# Altium project ip_phone.PrjPcb (part 1 of 2)
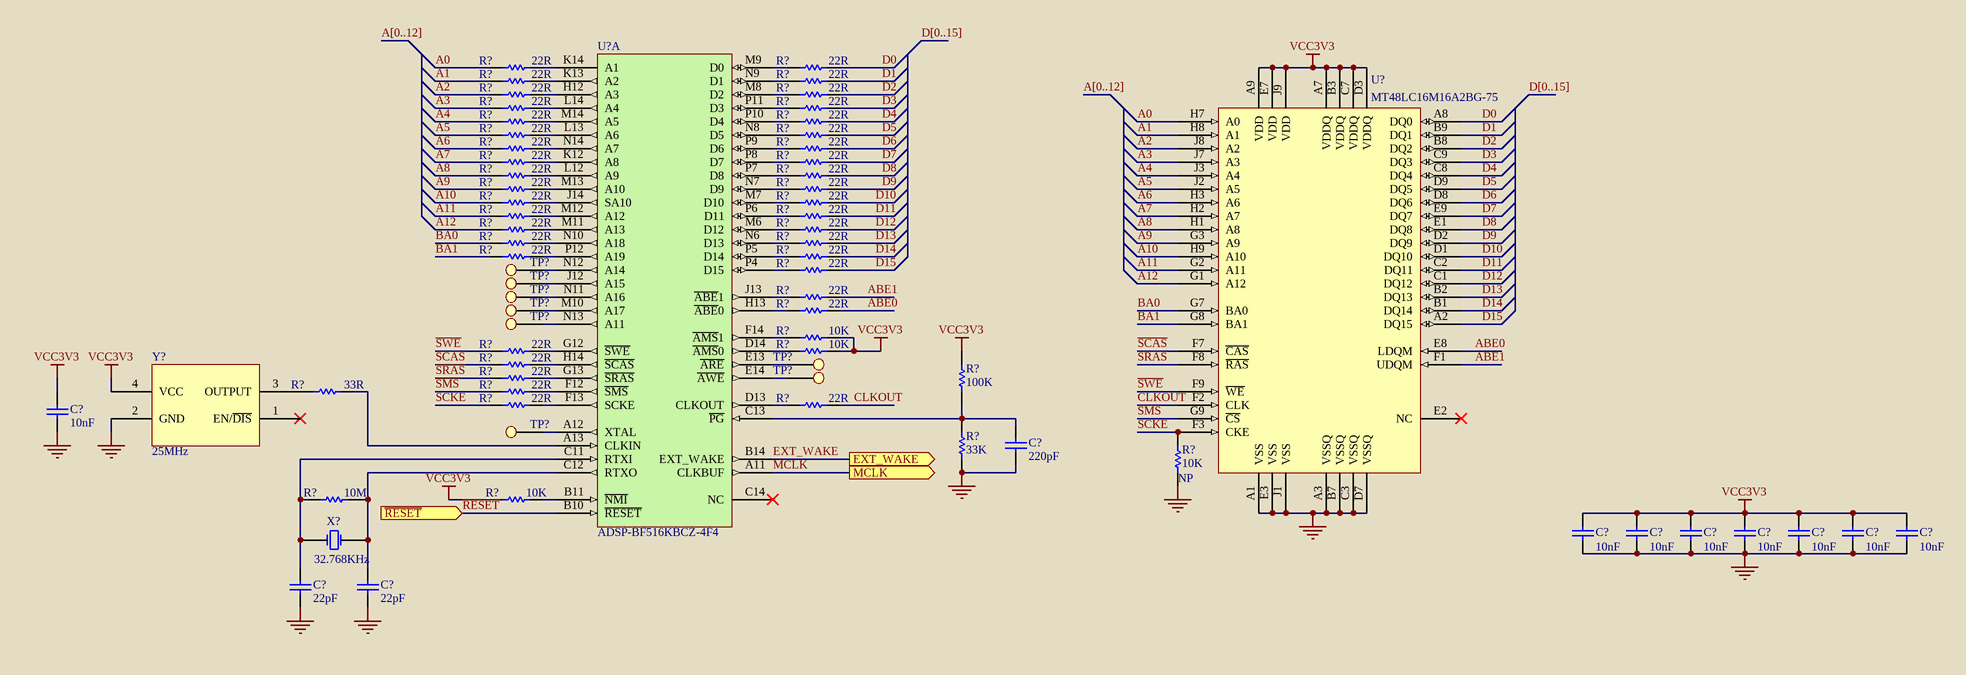
[diagram p0: ip_phone_a_sdram.SchDoc]
6 sheets, 384 parts. Net scope: flat (ports and power ports of the same name join across sheets).
Board file: ip_phone_pcb.PcbDoc
Sheets:
  ip_phone_a_sdram.SchDoc
  ip_phone_b_miscellaneous.SchDoc
  ip_phone_c_codec.SchDoc
  ip_phone_d_lcd_keyboard.SchDoc
  ip_phone_e_wifi.SchDoc
  ip_phone_f_power.SchDoc

## Sheet ip_phone_a_sdram.SchDoc: SDRAM
size A3; SheetNumber: 1; SheetTotal: 6

### Parts
C100  10nF  [CC1005-0402]
C101  220pF  [CC1005-0402]
C102  10nF  [CC1005-0402]
C103  10nF  [CC1005-0402]
C104  10nF  [CC1005-0402]
C105  10nF  [CC1005-0402]
C106  10nF  [CC1005-0402]
C107  10nF  [CC1005-0402]
C108  10nF  [CC1005-0402]
C109  22pF  [CC1005-0402]
C110  22pF  [CC1005-0402]
R100  22R  [CR1005-0402]
R101  22R  [CR1005-0402]
R102  22R  [CR1005-0402]
R103  22R  [CR1005-0402]
R104  22R  [CR1005-0402]
R105  22R  [CR1005-0402]
R106  22R  [CR1005-0402]
R107  22R  [CR1005-0402]
R108  22R  [CR1005-0402]
R109  22R  [CR1005-0402]
R110  22R  [CR1005-0402]
R111  22R  [CR1005-0402]
R112  22R  [CR1005-0402]
R113  22R  [CR1005-0402]
R114  22R  [CR1005-0402]
R115  22R  [CR1005-0402]
R116  22R  [CR1005-0402]
R117  22R  [CR1005-0402]
R118  22R  [CR1005-0402]
R119  22R  [CR1005-0402]
R120  22R  [CR1005-0402]
R121  22R  [CR1005-0402]
R122  22R  [CR1005-0402]
R123  22R  [CR1005-0402]
R124  22R  [CR1005-0402]
R125  22R  [CR1005-0402]
R126  22R  [CR1005-0402]
R127  22R  [CR1005-0402]
R128  22R  [CR1005-0402]
R129  22R  [CR1005-0402]
R130  22R  [CR1005-0402]
R131  22R  [CR1005-0402]
R132  22R  [CR1005-0402]
R133  10K  [CR1005-0402]
R134  22R  [CR1005-0402]
R135  10K  [CR1005-0402]
R136  22R  [CR1005-0402]
R137  100K  [CR1005-0402]
R138  22R  [CR1005-0402]
R139  33R  [CR1005-0402]
R140  22R  [CR1005-0402]
R141  22R  [CR1005-0402]
R142  22R  [CR1005-0402]
R143  33K  [CR1005-0402]
R144  10K  [CR1005-0402_NP]
R145  10M  [CR1005-0402]
R146  10K  [CR1005-0402]
TP100  Test Point  [Test Point]  (value not drawn)
TP101  Test Point  [Test Point]  (value not drawn)
TP102  Test Point  [Test Point]  (value not drawn)
TP103  Test Point  [Test Point]  (value not drawn)
TP104  Test Point  [Test Point]  (value not drawn)
TP105  Test Point  [Test Point]  (value not drawn)
TP106  Test Point  [Test Point]  (value not drawn)
TP107  Test Point  [Test Point]  (value not drawn)
U101  MT48LC16M16A2BG-75  [VFBGA54]
U?  ADSP-BF516KBCZ-4F4  [BGA168]  (part A of 3)
X100  32.768KHz  [XTAL_32.768kHz]
Y100  25MHz  [OSC_25MHz]

### Ports
EXT_WAKE (out), MCLK (out), ~{RESET} (in)

### Nets
GND: C100.1 C101.1 C102.1 C103.1 C104.1 C105.1 C106.1 C107.1 C108.1 C109.1 C110.1 R143.1 R144.1 U101.A1(VSS) U101.A3(VSSQ) U101.B7(VSSQ) U101.C3(VSSQ) U101.D7(VSSQ) U101.E3(VSS) U101.J1(VSS) Y100.2(GND)  [project net AGND]
VCC3V3: C100.2 C102.2 C103.2 C104.2 C105.2 C106.2 C107.2 C108.2 R133.2 R135.2 R137.2 R146.1 U101.A7(VDDQ) U101.A9(VDD) U101.B3(VDDQ) U101.C7(VDDQ) U101.D3(VDDQ) U101.E7(VDD) U101.J9(VDD) Y100.4(VCC)
~{RESET}: U?.B10(~{RESET}) ; port ~{RESET}
A0: R100.1 U101.H7(A0)
A1: R102.1 U101.H8(A1)
A2: R104.1 U101.J8(A2)
A3: R106.1 U101.J7(A3)
A4: R108.1 U101.J3(A4)
A5: R110.1 U101.J2(A5)
A6: R112.1 U101.H3(A6)
A7: R114.1 U101.H2(A7)
A8: R116.1 U101.H1(A8)
A9: R118.1 U101.G3(A9)
A10: R120.1 U101.H9(A10)
A11: R122.1 U101.G2(A11)
A12: R124.1 U101.G1(A12)
ABE0: R132.2 U101.E8(LDQM)
ABE1: R131.2 U101.F1(UDQM)
BA0: R126.1 U101.G7(BA0)
BA1: R128.1 U101.G8(BA1)
CLKOUT: R142.2 U101.F2(CLK)
D0: R101.2 U101.A8(DQ0)
D1: R103.2 U101.B9(DQ1)
D2: R105.2 U101.B8(DQ2)
D3: R107.2 U101.C9(DQ3)
D4: R109.2 U101.C8(DQ4)
D5: R111.2 U101.D9(DQ5)
D6: R113.2 U101.D8(DQ6)
D7: R115.2 U101.E9(DQ7)
D8: R117.2 U101.E1(DQ8)
D9: R119.2 U101.D2(DQ9)
D10: R121.2 U101.D1(DQ10)
D11: R123.2 U101.C2(DQ11)
D12: R125.2 U101.C1(DQ12)
D13: R127.2 U101.B2(DQ13)
D14: R129.2 U101.B1(DQ14)
D15: R130.2 U101.A2(DQ15)
EXT_WAKE: U?.B14(EXT_WAKE) ; port EXT_WAKE
MCLK: U?.A11(CLKBUF) ; port MCLK
~{SCAS}: R136.1 U101.F7(~{CAS})
~{SMS}: R140.1 U101.G9(~{CS})
~{SRAS}: R138.1 U101.F8(~{RAS})
~{SWE}: R134.1 U101.F9(~{WE})
SCKE: R141.1 R144.2 U101.F3(CKE)
NetC101_2: C101.2 R137.1 R143.2 U?.C13(~{PG})
NetC109_2: C109.2 R145.1 U?.C11(RTXI) X100.1(OSC1)
NetC110_2: C110.2 R145.2 U?.C12(RTXO) X100.4(OSC2)
NetR100_2: R100.2 U?.K14(A1)
NetR101_1: R101.1 U?.M9(D0)
NetR102_2: R102.2 U?.K13(A2)
NetR103_1: R103.1 U?.N9(D1)
NetR104_2: R104.2 U?.H12(A3)
NetR105_1: R105.1 U?.M8(D2)
NetR106_2: R106.2 U?.L14(A4)
NetR107_1: R107.1 U?.P11(D3)
NetR108_2: R108.2 U?.M14(A5)
NetR109_1: R109.1 U?.P10(D4)
NetR110_2: R110.2 U?.L13(A6)
NetR111_1: R111.1 U?.N8(D5)
NetR112_2: R112.2 U?.N14(A7)
NetR113_1: R113.1 U?.P9(D6)
NetR114_2: R114.2 U?.K12(A8)
NetR115_1: R115.1 U?.P8(D7)
NetR116_2: R116.2 U?.L12(A9)
NetR117_1: R117.1 U?.P7(D8)
NetR118_2: R118.2 U?.M13(A10)
NetR119_1: R119.1 U?.N7(D9)
NetR120_2: R120.2 U?.J14(SA10)
NetR121_1: R121.1 U?.M7(D10)
NetR122_2: R122.2 U?.M12(A12)
NetR123_1: R123.1 U?.P6(D11)
NetR124_2: R124.2 U?.M11(A13)
NetR125_1: R125.1 U?.M6(D12)
NetR126_2: R126.2 U?.N10(A18)
NetR127_1: R127.1 U?.N6(D13)
NetR128_2: R128.2 U?.P12(A19)
NetR129_1: R129.1 U?.P5(D14)
NetR130_1: R130.1 U?.P4(D15)
NetR131_1: R131.1 U?.J13(~{ABE}1)
NetR132_1: R132.1 U?.H13(~{ABE}0)
NetR133_1: R133.1 U?.F14(~{AMS}1)
NetR134_2: R134.2 U?.G12(~{SWE})
NetR135_1: R135.1 U?.D14(~{AMS}0)
NetR136_2: R136.2 U?.H14(~{SCAS})
NetR138_2: R138.2 U?.G13(~{SRAS})
NetR139_1: R139.1 Y100.3(OUTPUT)
NetR139_2: R139.2 U?.A13(CLKIN)
NetR140_2: R140.2 U?.F12(~{SMS})
NetR141_2: R141.2 U?.F13(SCKE)
NetR142_1: R142.1 U?.D13(CLKOUT)
NetR146_2: R146.2 U?.B11(~{NMI})
NetTP100_1: TP100.1 U?.J12(A15)
NetTP101_1: TP101.1 U?.N11(A16)
NetTP102_1: TP102.1 U?.M10(A17)
NetTP103_1: TP103.1 U?.N13(A11)
NetTP104_1: TP104.1 U?.E13(~{ARE})
NetTP105_1: TP105.1 U?.E14(~{AWE})
NetTP106_1: TP106.1 U?.A12(XTAL)
NetTP107_1: TP107.1 U?.N12(A14)

Not connected (* = marked no-connect by the designer): U101 E2(NC)*; U? C14(NC)*; Y100 1(EN/~{DIS})*

### Buses and harness runs
bus A[0..12]
bus D[0..15]

### Notes on the sheet
- Título:
- Universidade Federal do Ceará
- Padrão:
- Projeto:
- A3
- Blackfin IP Phone
- Data:
- Versão:
- Folha:
- V1
- de
- Centro de Tecnologia
- Dep. de Eng. de Teleinformática
- Fortaleza - Ceará - Brasil
- Arquivo:

### Library data of the parts
C100 = Capacitor: Ceramic Capacitor 10nF 50V X7R 0402; eVendorPart#: 311-1349-1-ND; Manufacturer: Yageo; Part#: CC0402KRX7R9BB103; eVendor: Digikey; eVendorPrice: 0,015; MSRP: 0,00335; MOQ: 1000
C101 = Capacitor: eVendorPart#: 311-1035-1-ND; Manufacturer: Yageo; Part#: CC0402KRX7R9BB221; eVendor: Digikey; eVendorPrice: 0,015; MSRP: 0,00335; MOQ: 1000
C102-C108 = Capacitor: Ceramic Capacitor 0.01uF 50V X7R 0402; eVendorPart#: 311-1349-1-ND; Manufacturer: Yageo; Part#: CC0402KRX7R9BB103; eVendor: Digikey; eVendorPrice: 0,015; MSRP: 0,00335; MOQ: 1000
C109 C110 = Capacitor: Ceramic Capacitor 22pF 50V 5% C0G 0402; eVendorPart#: 490-1283-1-ND; Manufacturer: Murata Electronics North America; Part#: GRM1555C1H220JZ01D; eVendor: Digikey; eVendorPrice: 0,028; MSRP: 0,00614; MOQ: 1000
R100-R132 R134 R136 R138 R140-R142 = Resistor: Thick Film Resistors SMD 0402 22R 5%  1/16 W; eVendorPart#: 71-CRCW0402J-22-E3; Manufacturer: Vishay/Dale; Part#: CRCW040222R0JNED; eVendor: Mouser; eVendorPrice: 0,08; MSRP: 0,015; MOQ: 1000
R133 = Resistor: Thick Film Resistors SMD 0402 10k 5%  1/16 W; eVendorPart#: 311-10KJRCT-ND; Manufacturer: Yageo; Part#: RC0402JR-0710KL; eVendor: Digikey; eVendorPrice: 0,012; MSRP: 0,00253; MOQ: 1000
R135 = Resistor: Thick Film Resistors SMD 0402 10k 5%  1/16 W; eVendorPart#: 311-10KJRCT-ND; Manufacturer: Yageo; Part#: RC0402JR-0710KL; eVendor: Digikey; eVendorPrice: 0,0012; MSRP: 0,00253; MOQ: 1000
R137 = Resistor: Thick Film Resistors SMD 0402 100K 5%  1/16 W; eVendorPart#: 311-100KJRCT-ND; Manufacturer: Yageo; Part#: RC0402JR-07100KL; eVendor: Digikey; eVendorPrice: 0,012; MSRP: 0,00253; MOQ: 1000
R139 = Resistor: Thick Film Resistors SMD 0402 33R 5%  1/16 W; eVendorPart#: 311-33JRCT-ND; Manufacturer: Yageo; Part#: RC0402JR-0733RL; eVendor: Digikey; eVendorPrice: 0,012; MSRP: 0,00253; MOQ: 1000
R143 = Resistor: Thick Film Resistors SMD 0402 33K 5%  1/16 W; eVendorPart#: 311-33KJRCT-ND; Manufacturer: Yageo; Part#: RC0402JR-0733KL; eVendor: Digikey; eVendorPrice: 0,012; MSRP: 0,00253; MOQ: 1000
R144 R146 = Resistor: Thick Film Resistors SMD 0402 10K 5%  1/16 W; eVendorPart#: 311-10KJRCT-ND; Manufacturer: Yageo; Part#: RC0402JR-0710KL; eVendor: Digikey; eVendorPrice: 0,012; MSRP: 0,00253; MOQ: 1000
  R?#45: NP: NP
R145 = Resistor: Thick Film Resistors SMD 0402 10M 5%  1/16 W; eVendorPart#: RMCF0402JT10M0CT-ND; Manufacturer: Stackpole Electronics Inc; Part#: RMCF0402JT10M0; eVendor: Digikey; eVendorPrice: 0,02; MSRP: 0,00256; MOQ: 1000
TP100-TP107 = Test Point: eVendor: NÃO SE APLICA; eVendorPrice: 0,00; eVendorPart#: NÃO SE APLICA; Part#: NÃO SE APLICA; Manufacturer: NÃO SE APLICA; MOQ: 1000; MSRP: 0,00
U101 = MT48LC16M16A2BG-75: SDRAM 256M-Bit 16Mx16 3.3V 54-Pin VFBGA Tray; eVendorPart#: MT48LC16M16A2BG-75 IT:D; Manufacturer: Micron; eVendor: Avnet; eVendorPrice: 9,23; MSRP: 8,33; eVendorPart#: ADSP-BF516KBCZ-4F4; MOQ: 500; Part#: ADSP-BF516KBCZ-4F4
U? = ADSP-BF516KBCZ-4F4: Low Power Blackfin with Advanced Embedded Connectivity; Manufacturer: Analog Device; eVendor: Avnet; eVendorPrice: 19,42; MSRP: 14,15; MOQ: 100; Part#: MT48LC16M16A2BG-75 IT:D
X100 = XTAL_32.768KHz: Crystal 32.768KHz; eVendorPart#: 732-MC30632.7680KA0R; Part#: MC-306 32.7680K-A0:ROHS; Manufacturer: Epson; eVendor: Mouser; eVendorPrice: 0,95; MSRP: 0,378; MOQ: 1000
Y100 = Oscillator_25MHz: Crystal Clock Oscillator 25MHz  50ppm 3.3V; eVendorPart#: 300-8254-1-ND; Part#: ASFL1-25.000MHZ-EC-T; Manufacturer: ABRACON; eVendor: Digikey; eVendorPrice: 2,55; MSRP: 1,292; MOQ: 1000

## Sheet ip_phone_b_miscellaneous.SchDoc: MISCELLANEOUS
size A3; SheetNumber: 2; SheetTotal: 6
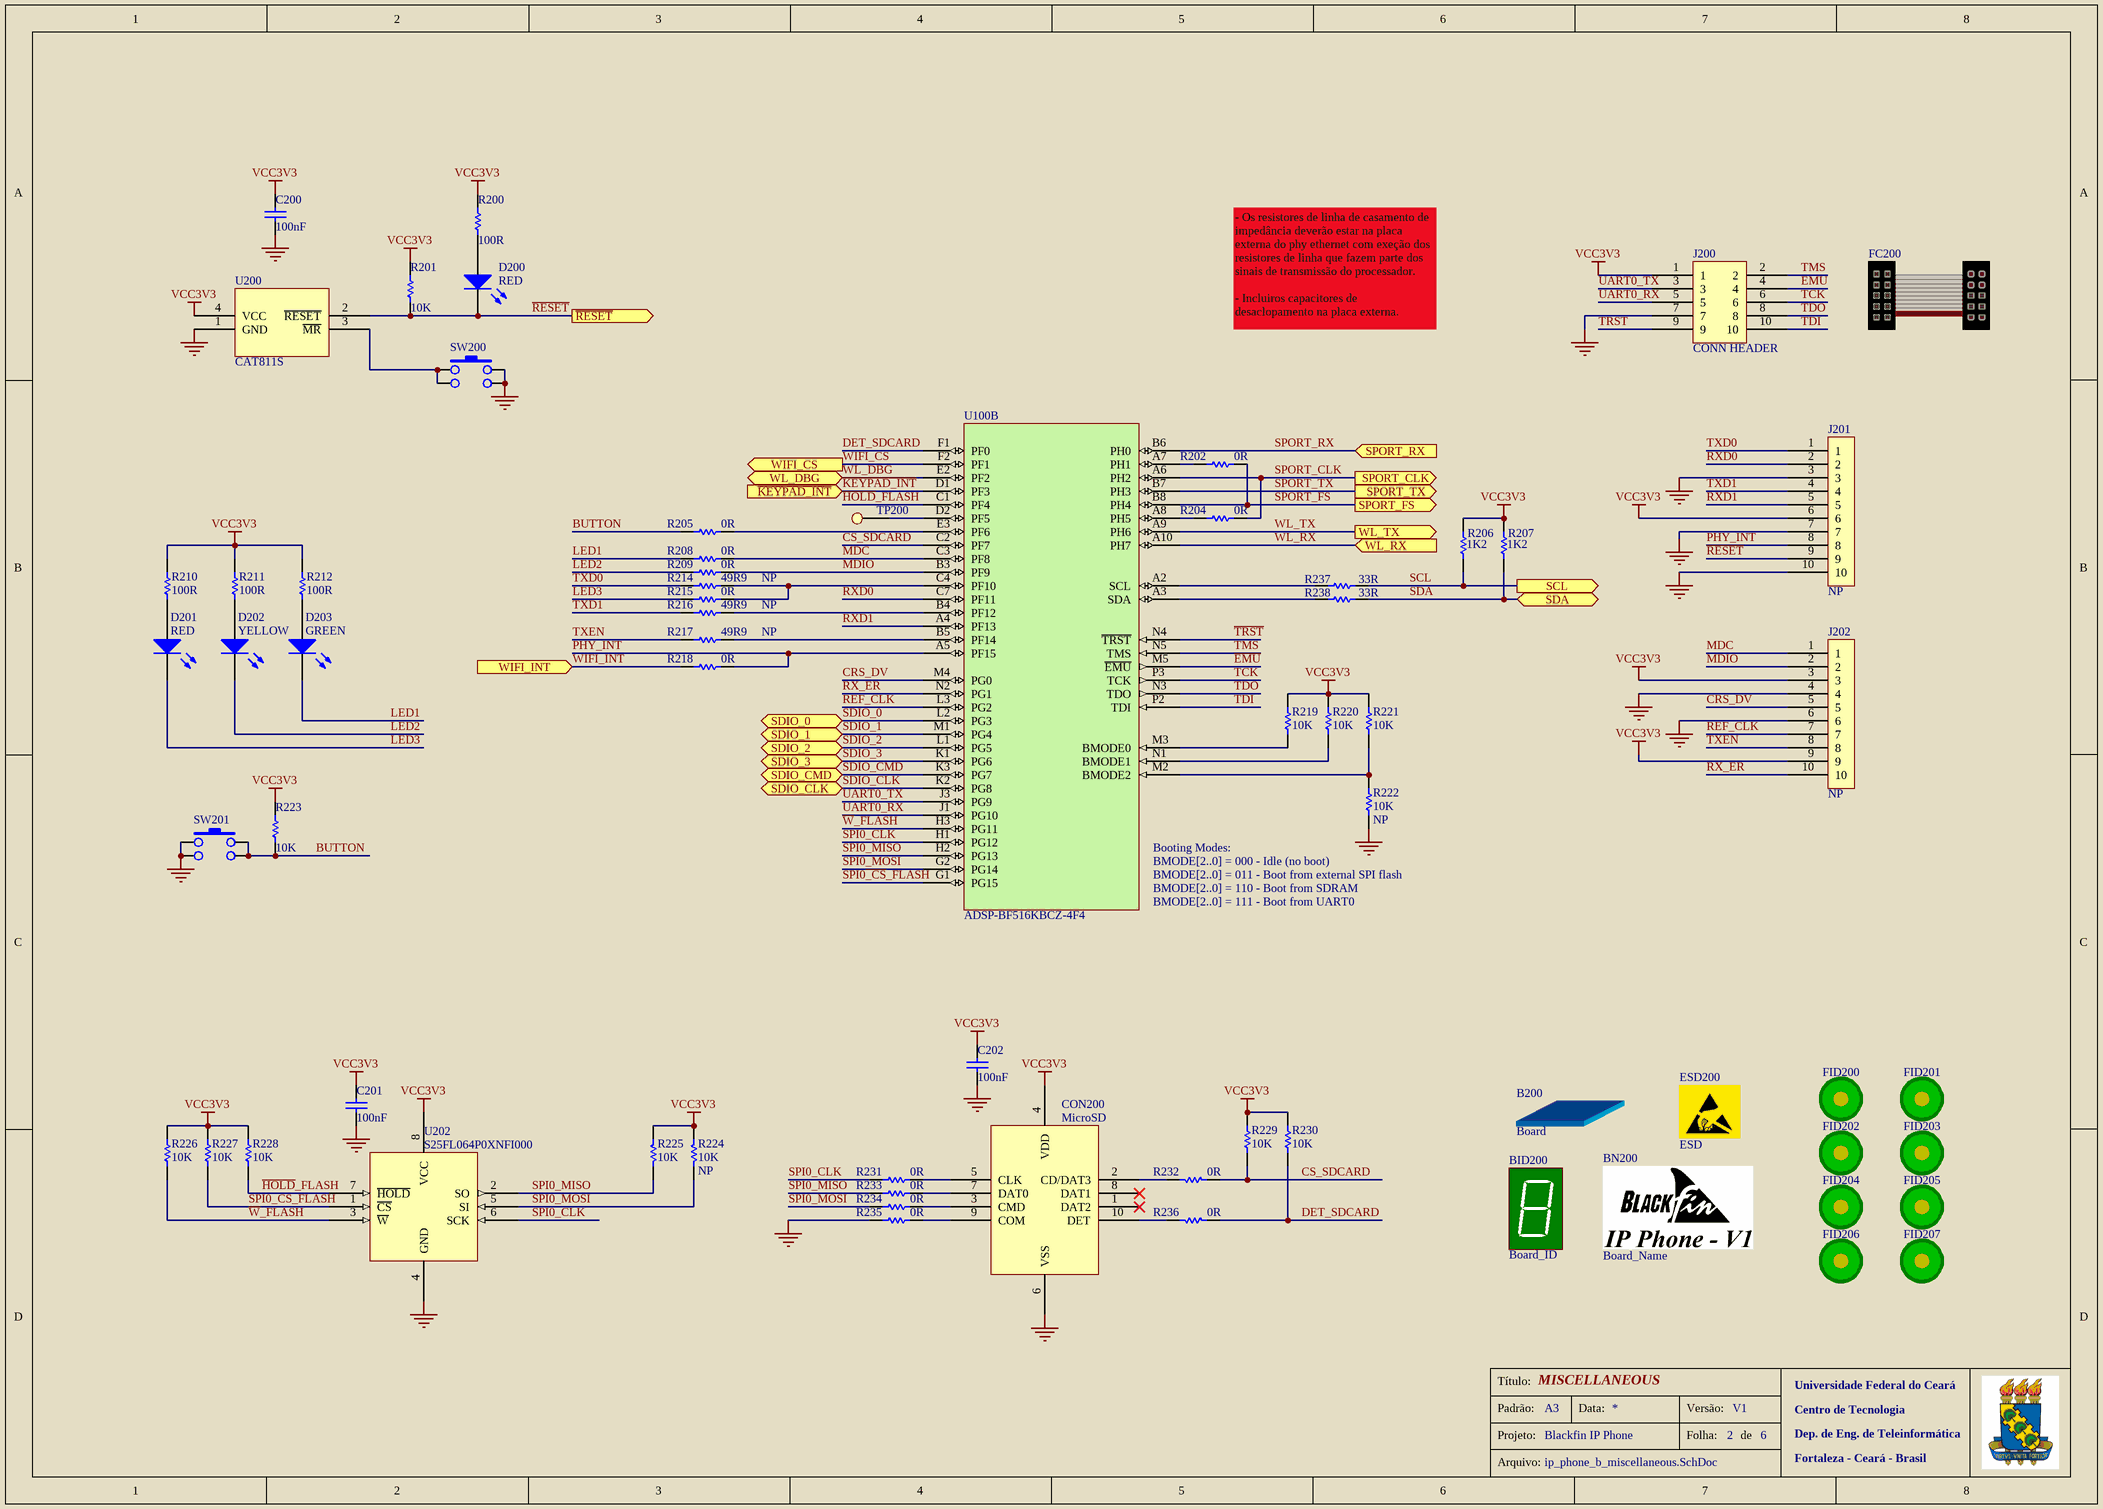
[diagram p1: ip_phone_b_miscellaneous.SchDoc]

### Parts
B200  Board  (no BOM)
BID200  Board_ID  [BOARD_ID]  (no BOM)
BN200  Board_Name  [LOGO]  (no BOM)
C200  100nF  [CC1005-0402]
C201  100nF  [CC1005-0402]
C202  100nF  [CC1005-0402]
CON200  MicroSD  [MICRO_SD]
D200  RED  [LED_0603]
D201  RED  [LED 3MM VERMELHO PF-D3]
D202  YELLOW  [LED 3MM AMARELO PF-D3]
D203  GREEN  [LED 3MM VERDE PF-D3]
ESD200  ESD  [ESD]  (no BOM)
FC200  Flat Cable  (value not drawn)  (mechanical)
FID200  Fiducial  [Fiducial]  (value not drawn)  (no BOM)
FID201  Fiducial  [Fiducial]  (value not drawn)  (no BOM)
FID202  Fiducial  [Fiducial]  (value not drawn)  (no BOM)
FID203  Fiducial  [Fiducial]  (value not drawn)  (no BOM)
FID204  Fiducial  [Fiducial]  (value not drawn)  (no BOM)
FID205  Fiducial  [Fiducial]  (value not drawn)  (no BOM)
FID206  Fiducial  [Fiducial]  (value not drawn)  (no BOM)
FID207  Fiducial  [Fiducial]  (value not drawn)  (no BOM)
J200  CONN HEADER  [CON_JTAG]
J201  CONN HEADER  [CONECTOR_10_PIN]  (value not drawn)
J202  CONN HEADER  [CONECTOR_10_PIN]  (value not drawn)
R200  100R  [CR1608-0603]
R201  10K  [CR1005-0402]
R202  0R  [CR1005-0402]
R204  0R  [CR1005-0402]
R205  0R  [CR1005-0402]
R206  1K2  [CR1005-0402]
R207  1K2  [CR1005-0402]
R208  0R  [CR1005-0402]
R209  0R  [CR1005-0402]
R210  100R  [CR1608-0603]
R211  100R  [CR1608-0603]
R212  100R  [CR1608-0603]
R214  49R9  [CR1005-0402_NP]
R215  0R  [CR1005-0402]
R216  49R9  [CR1005-0402_NP]
R217  49R9  [CR1005-0402_NP]
R218  0R  [CR1005-0402]
R219  10K  [CR1005-0402]
R220  10K  [CR1005-0402]
R221  10K  [CR1005-0402]
R222  10K  [CR1005-0402_NP]
R223  10K  [CR1005-0402]
R224  10K  [CR1005-0402_NP]
R225  10K  [CR1005-0402]
R226  10K  [CR1005-0402]
R227  10K  [CR1005-0402]
R228  10K  [CR1005-0402]
R229  10K  [CR1005-0402]
R230  10K  [CR1005-0402]
R231  0R  [CR1005-0402]
R232  0R  [CR1005-0402]
R233  0R  [CR1005-0402]
R234  0R  [CR1005-0402]
R235  0R  [CR1005-0402]
R236  0R  [CR1005-0402]
R237  33R  [CR1005-0402]
R238  33R  [CR1005-0402]
SW200  SW  [PUSH-PTS525]  (value not drawn)
SW201  SW  [PUSH-PTS525]  (value not drawn)
TP200  Test Point  [Test Point]  (value not drawn)  (no BOM)
U100  ADSP-BF516KBCZ-4F4  [BGA168]  (part B of 3)
U200  CAT811S  [SOT-143]
U202  S25FL064P0XNFI000  [WSON8]

### Ports
SCL (out), SDA (bidir), SDIO_0 (bidir), SDIO_1 (bidir), SDIO_2 (bidir), SDIO_3 (bidir), SDIO_CLK (bidir), SDIO_CMD (bidir), SPORT_CLK (out), SPORT_FS (out), SPORT_RX (in), SPORT_TX (out), WIFI_CS (out), WIFI_INT (in), WL_DBG (bidir), WL_RX (in), WL_TX (out), ~{KEYPAD_INT} (in), ~{RESET} (out)

### Nets
GND: C200.1 C201.1 C202.1 CON200.6(VSS) J200.7 J201.3 J201.7 J201.10 J202.4 J202.6 R222.1 R235.1 SW200.1 SW200.2 SW201.1 SW201.2 U200.1(GND) U202.4(GND)  [project net AGND]
VCC3V3: C200.2 C201.2 C202.2 CON200.4(VDD) J200.1 J201.6 J202.3 J202.9 R200.2 R201.2 R206.1 R207.1 R210.2 R211.2 R212.2 R219.2 R220.2 R221.2 R223.2 R224.2 R225.2 R226.2 R227.2 R228.2 R229.2 R230.2 U200.4(VCC) U202.8(VCC)
~{EMU}: J200.4 U100.M5(~{EMU})
~{HOLD}_FLASH: R228.1 U100.C1(PF4) U202.7(~{HOLD})
~{KEYPAD_INT}: U100.D1(PF3) ; port ~{KEYPAD_INT}
~{RESET}: D200.2(K) J201.9 R201.1 U200.2(~{RESET}) ; port ~{RESET}
~{TRST}: J200.9 U100.N4(~{TRST})
~{W}_FLASH: R226.1 U100.H3(PG11) U202.3(~{W})
BUTTON: R205.1 R223.1 SW201.3 SW201.4
CRS_DV: J202.5 U100.M4(PG0)
CS_SDCARD: R229.1 R232.1 U100.C2(PF7)
DET_SDCARD: R230.1 R236.1 U100.F1(PF0)
LED1: D203.2(K) R208.1
LED2: D202.2(K) R209.1
LED3: D201.2(K) R215.1
MDC: J202.1 R208.2 U100.C3(PF8)
MDIO: J202.2 R209.2 U100.B3(PF9)
~{PHY_INT}: J201.8 R218.2 U100.A5(PF15)
REF_CLK: J202.7 U100.L3(PG2)
RX_ER: J202.10 U100.N2(PG1)
RXD0: J201.2 U100.C7(PF11)
RXD1: J201.5 U100.A4(PF13)
SCL: R206.2 R237.2 ; port SCL
SDA: R207.2 R238.2 ; port SDA
SDIO_0: U100.L2(PG3) ; port SDIO_0
SDIO_1: U100.M1(PG4) ; port SDIO_1
SDIO_2: U100.L1(PG5) ; port SDIO_2
SDIO_3: U100.K1(PG6) ; port SDIO_3
SDIO_CLK: U100.K2(PG8) ; port SDIO_CLK
SDIO_CMD: U100.K3(PG7) ; port SDIO_CMD
SPI0~{_CS}_FLASH: R227.1 U100.G1(PG15) U202.1(~{CS})
SPI0_CLK: R231.1 U100.H1(PG12) U202.6(SCK)
SPI0_MISO: R225.1 R233.1 U100.H2(PG13) U202.2(SO)
SPI0_MOSI: R224.1 R234.1 U100.G2(PG14) U202.5(SI)
SPORT_CLK: R204.2 U100.A6(PH2) ; port SPORT_CLK
SPORT_FS: R202.2 U100.B8(PH4) ; port SPORT_FS
SPORT_RX: U100.B6(PH0) ; port SPORT_RX
SPORT_TX: U100.B7(PH3) ; port SPORT_TX
TCK: J200.6 U100.P3(TCK)
TDI: J200.10 U100.P2(TDI)
TDO: J200.8 U100.N3(TDO)
TMS: J200.2 U100.N5(TMS)
TXD0: J201.1 R214.1
TXD1: J201.4 R216.1
TXEN: J202.8 R217.1
UART0_RX: J200.5 U100.J1(PG10)
UART0_TX: J200.3 U100.J3(PG9)
WIFI_CS: U100.F2(PF1) ; port WIFI_CS
WIFI_INT: R218.1 ; port WIFI_INT
WL_DBG: U100.E2(PF2) ; port WL_DBG
WL_RX: U100.A10(PH7) ; port WL_RX
WL_TX: U100.A9(PH6) ; port WL_TX
NetCON200_2: CON200.2(CD/DAT3) R232.2
NetCON200_3: CON200.3(CMD) R234.2
NetCON200_5: CON200.5(CLK) R231.2
NetCON200_7: CON200.7(DAT0) R233.2
NetCON200_9: CON200.9(COM) R235.2
NetCON200_10: CON200.10(DET) R236.2
NetD200_1: D200.1(A) R200.1
NetD201_1: D201.1(A) R210.1
NetD202_1: D202.1(A) R211.1
NetD203_1: D203.1(A) R212.1
NetR202_1: R202.1 U100.A7(PH1)
NetR204_1: R204.1 U100.A8(PH5)
NetR205_2: R205.2 U100.E3(PF6)
NetR214_2: R214.2 R215.2 U100.C4(PF10)
NetR216_2: R216.2 U100.B4(PF12)
NetR217_2: R217.2 U100.B5(PF14)
NetR219_1: R219.1 U100.M3(BMODE0)
NetR220_1: R220.1 U100.N1(BMODE1)
NetR221_1: R221.1 R222.2 U100.M2(BMODE2)
NetR237_1: R237.1 U100.A2(SCL)
NetR238_1: R238.1 U100.A3(SDA)
NetSW200_3: SW200.3 SW200.4 U200.3(~{MR})
NetTP200_1: TP200.1 U100.D2(PF5)

Not connected (* = marked no-connect by the designer): CON200 1(DAT2)* 8(DAT1)*

### Notes on the sheet
- - Os resistores de linha de casamento de impedância deverão estar na placa externa do phy ethernet com exeção dos resistores de linha que fazem parte dos sinais de transmissão do processador.
  - Incluiros capacitores de desaclopamento na placa externa.
- (near U100) Booting Modes:
- (near U100) BMODE[2..0] = 000 - Idle (no boot)
- (near U100) BMODE[2..0] = 011 - Boot from external SPI flash
- (near U100) BMODE[2..0] = 110 - Boot from SDRAM
- (near U100) BMODE[2..0] = 111 - Boot from UART0
- Título:
- Universidade Federal do Ceará
- Padrão:
- Projeto:
- A3
- Blackfin IP Phone
- Data:
- Versão:
- Folha:
- V1
- de
- Centro de Tecnologia
- Dep. de Eng. de Teleinformática
- Fortaleza - Ceará - Brasil
- Arquivo:

### Library data of the parts
BID200 = Board_ID: eVendor: NÃO SE APLICA; eVendorPrice: 0,00; eVendorPart#: NÃO SE APLICA; Part#: NÃO SE APLICA; Manufacturer: NÃO SE APLICA; MOQ: 1000; MSRP: 0,00
BN200 = Board_Name: eVendor: NÃO SE APLICA; eVendorPrice: 0,00; eVendorPart#: NÃO SE APLICA; Manufacturer: NÃO SE APLICA; MOQ: 1000; MSRP: 0,00; Part#: NÃO SE APLICA
C200-C202 = Capacitor: MLCC - SMD/SMT 0.1UF 16V 10% 0402; eVendorPart#: 810-C1005X7R1C104K; Manufacturer: TDK; Part#: C1005X7R1C104KT; eVendor: Mouser; eVendorPrice: 0,03; MSRP: 0,005; MOQ: 1000
CON200 = MicroSD: CONN MEMORY CARD SD SMD; Manufacturer: AVX Corporation; Part#: 045138008010890+; eVendorPart#: 478-4965-1-ND; MSRP: 2,394; eVendorPrice: 3,86; eVendor: Digikey; MOQ: 1000
D200 = LED: Part#: APT1608SURCK; Manufacturer: Kingbright; eVendorPart#: 604-APT1608SURCK; eVendor: Mouser; eVendorPrice: 0,16; MSRP: 0,06; MOQ: 1000
D201 = LED: Part#: TLHR4205; Manufacturer: Vishay Semiconductors; eVendorPart#: 78-TLHR4205; eVendor: Mouser; eVendorPrice: 0,11; MSRP: 0,065; MOQ: 1000
D202 = LED: Part#: TLHY4205; Manufacturer: Vishay Semiconductors; eVendorPart#: 78-TLHY4205; eVendor: Mouser; eVendorPrice: 0,13; MSRP: 0,082; MOQ: 1000
D203 = LED: Part#: TLHG4205; Manufacturer: Vishay Semiconductors; eVendorPart#: 78-TLHG4205; eVendor: Mouser; eVendorPrice: 0,10; MSRP: 0,064; MOQ: 1000
ESD200 = ESD: eVendor: NÃO SE APLICA; eVendorPrice: 0,00; eVendorPart#: NÃO SE APLICA; Part#: NÃO SE APLICA; MOQ: 0,00; MSRP: 0,00; Manufacturer: NÃO SE APLICA
FC200 = Flat_Cable: eVendorPart#: SAM8218-ND; Manufacturer: Samtec; eVendor: Digikey; MSRP: 6,20; eVendorPrice: 10,76; MOQ: 1000; Part#: SAM8218-ND
FID200-FID207 = Fiducial: eVendorPart#: NÃO SE APLICA; MSRP: 0,00; Manufacturer: NÃO SE APLICA; MOQ: 1000; Part#: NÃO SE APLICA; eVendor: NÃO SE APLICA; eVendorPrice: 0,00
J200 = Conector JTAG: CONN HEADER .050" 5x2; eVendorPart#: S9012E-05-ND; Manufacturer: Sullins; Part#: GRPB052VWQS-RC; eVendor: Digikey; eVendorPrice: 0,95; MSRP: 0,47; MOQ: 1000
J201 J202 = Conector 10pin: CONN HEADER .050" 10POS PCB GOLD; eVendorPart#: S9014E-10-ND; Manufacturer: Sullins Connector Solutions; Part#: GRPB101VWVN-RC; eVendor: Digikey; eVendorPrice: 0,66; MSRP: 0,32775; MOQ: 1000; NP: NP
R200 R210-R212 = Resistor: Thick Film Resistors 1/16WATT 100R 0402; eVendorPart#: 652-CR0603-JW-101GLF; Manufacturer: Bourns; Part#: CR0603-JW-101GLF; eVendor: Mouser; eVendorPrice: 0,06; MSRP: 0,01; MOQ: 1000
R201 R219-R230 = Resistor: as R144 on sheet ip_phone_a_sdram; MOQ: 1000
  R222 R224: NP: NP
R202 R204 R205 R208 R209 R215 R218 R231-R236 = Resistor: Thick Film Resistors 0402 1/16W Jumper; eVendorPart#: 667-ERJ-2GE0R00X; Manufacturer: Panasonic Electronic Components; Part#: ERJ-2GE0R00X; eVendor: Mouser; eVendorPrice: 0,05; MSRP: 0,004; MOQ: 1000
R206 R207 = Resistor: Thick Film Resistors SMD 0402 1K2 5%  1/16 W; eVendorPart#: 311-1.2KJRCT-ND; Manufacturer: Yageo; Part#: RC0402JR-071K2L; eVendor: Digikey; eVendorPrice: 0,012; MSRP: 0,00253; MOQ: 1000
R214 R216 R217 = Resistor: Thick Film Resistors - SMD 1/16watt 49.9ohms 1% 0402; eVendorPart#: 71-CRCW0402-49.9-E3; Manufacturer: Vishay/Dale; Part#: CRCW040249R9FKED; eVendor: Mouser; eVendorPrice: 0,07; MSRP: 0,015; MOQ: 1000; NP: NP
R237 R238 = Resistor: as R139 on sheet ip_phone_a_sdram; MOQ: 1000
SW200 SW201 = SWITCH_PUSH_NA_SMD: Switch tact, SMT, SPST, 160gf, 5.25 mm L x 5.25 mm W x 1.5 mm H; Manufacturer: C&K Components; Part#: PTS525SM10SMTR LFS; eVendorPart#: 611-PTS525SM10-LFS; eVendor: Mouser; eVendorPrice: 0,48; MSRP: 0,244; MOQ: 1000
TP200 = Test Point: as TP100 on sheet ip_phone_a_sdram; eVendorPart#: NÃO SE APLICA; Part#: NÃO SE APLICA; Manufacturer: NÃO SE APLICA; MOQ: 1000; MSRP: 0,00
U100 = ADSP-BF516KBCZ-4F4: as U? on sheet ip_phone_a_sdram; eVendorPart#: ADSP-BF516KBCZ-4F4; MOQ: 500; Part#: ADSP-BF516KBCZ-4F4
U200 = CAT811S: IC Supervisor MPU 2.93V  SOT-143; Part#: CAT811STBI-GT3; Manufacturer: ON Semiconductor; eVendorPart#: 698-CAT811STBI-GT3; eVendor: Mouser; eVendorPrice: 0,22; MSRP: 0,156; MOQ: 1000
U202 = S25FL064P0XNFI000: Flash Mem Serial-SPI 3V/3.3V 64M-Bit 64M x 1 8ns 8-Pin WSON Tray; Manufacturer: Spansion; eVendor: Avnet; eVendorPrice: 1,99; MSRP: 1,88; eVendorPart#: S25FL064P0XNFI000; Part#: S25FL064P0XNFI000; MOQ: 100
B200 = Board: eVendor: *; eVendorPart#: *; Part#: *; eVendorPrice: *; MOQ: *; MSRP: *; Manufacturer: *

## Sheet ip_phone_c_codec.SchDoc: CODEC
size A3; Organization: Instituto Atlântico; Address1: Rua Chico Lemos, 946; Address2: Cidade dos Funcionários; Address3: CEP: 60822-780; Address4: Fortaleza - CE; SheetNumber: 3; SheetTotal: 6
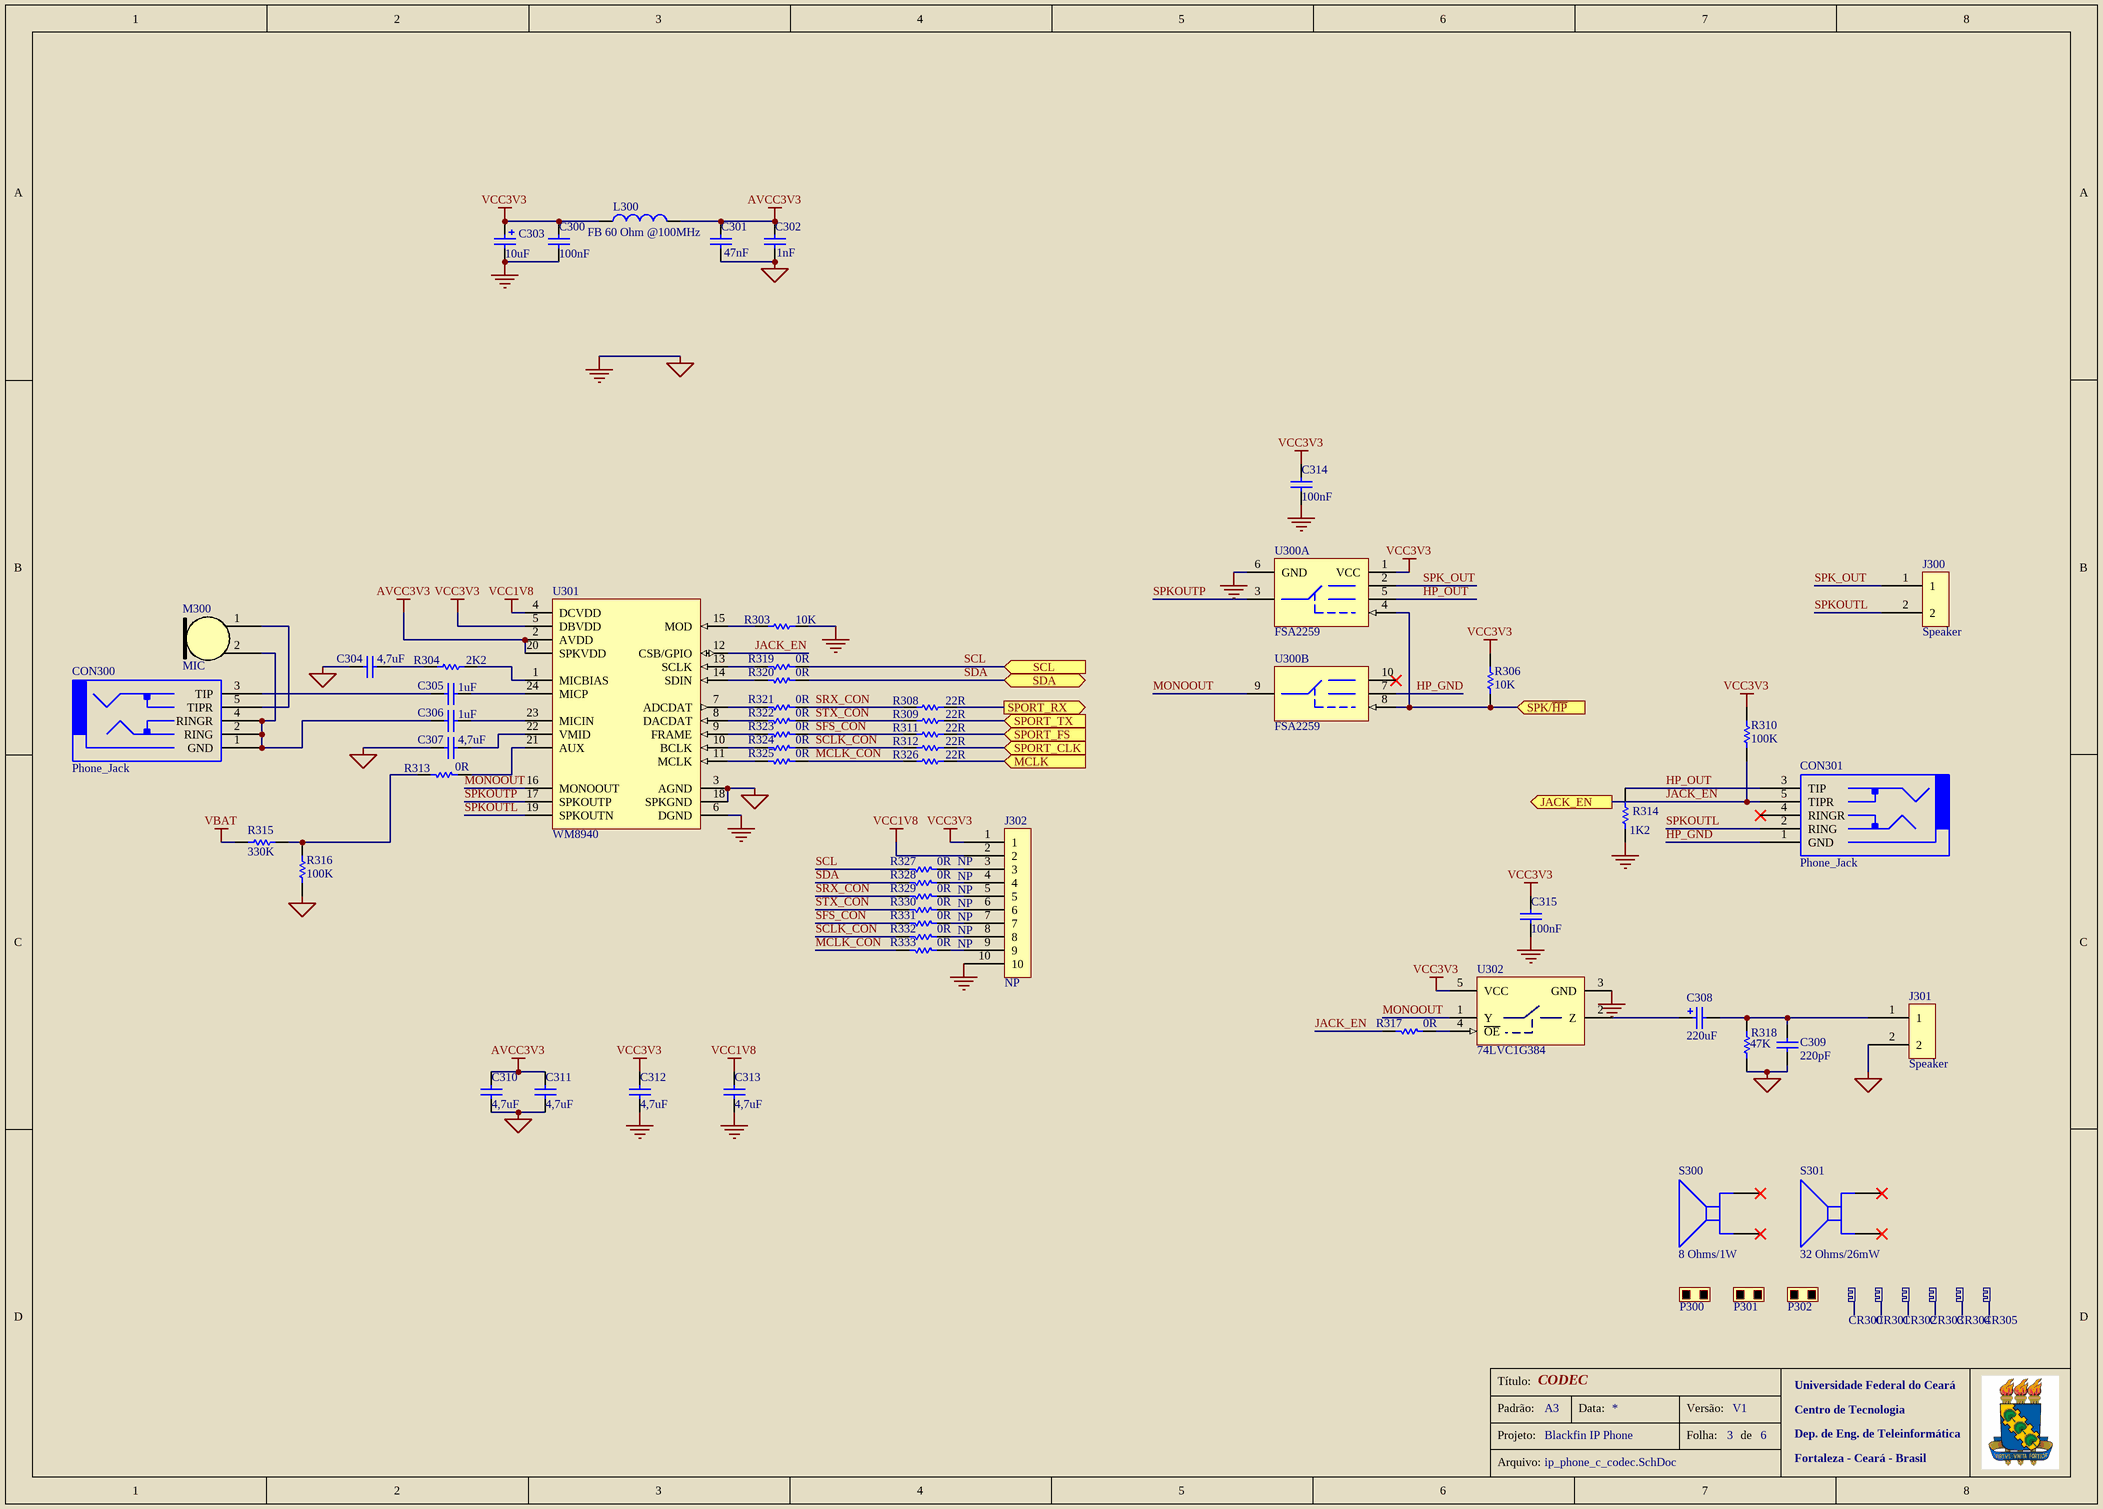
[diagram p2: ip_phone_c_codec.SchDoc]

### Parts
C300  100nF  [CC1005-0402]
C301  47nF  [CC1005-0402]
C302  1nF  [CC1005-0402]
C303  10uF  [VE-100M0JTR-0305]
C304  4,7uF  [CC1005-0402]
C305  1uF  [CC1005-0402]
C306  1uF  [CC1005-0402]
C307  4,7uF  [CC1005-0402]
C308  220uF  [CAP_VE221]
C309  220pF  [CC1005-0402]
C310  4,7uF  [CC1005-0402]
C311  4,7uF  [CC1005-0402]
C312  4,7uF  [CC1005-0402]
C313  4,7uF  [CC1005-0402]
C314  100nF  [CC1005-0402]
C315  100nF  [CC1005-0402]
CON300  Phone_Jack  [Phone_Jack]
CON301  Phone_Jack  [Phone_Jack]
CR300  Crimp  (value not drawn)  (mechanical)
CR301  Crimp  (value not drawn)  (mechanical)
CR302  Crimp  (value not drawn)  (mechanical)
CR303  Crimp  (value not drawn)  (mechanical)
CR304  Crimp  (value not drawn)  (mechanical)
CR305  Crimp  (value not drawn)  (mechanical)
J300  Speaker  [CON_IL-Z-2PL]
J301  Speaker  [CON_IL-Z-2PL]
J302  CONN HEADER  [CONECTOR_10_PIN]  (value not drawn)
L300  FB 60 Ohm @100MHz  [INDUTOR_0603]
M300  MIC  [CON_IL-Z-2PL]
P300  Socket Housing  (value not drawn)  (mechanical)
P301  Socket Housing  (value not drawn)  (mechanical)
P302  Socket Housing  (value not drawn)  (mechanical)
R303  10K  [CR1005-0402]
R304  2K2  [CR1005-0402]
R306  10K  [CR1005-0402]
R308  22R  [CR1005-0402]
R309  22R  [CR1005-0402]
R310  100K  [CR1005-0402]
R311  22R  [CR1005-0402]
R312  22R  [CR1005-0402]
R313  0R  [CR1005-0402]
R314  1K2  [CR1005-0402]
R315  330K  [CR1005-0402]
R316  100K  [CR1005-0402]
R317  0R  [CR1005-0402]
R318  47K  [CR1005-0402]
R319  0R  [CR1005-0402]
R320  0R  [CR1005-0402]
R321  0R  [CR1005-0402]
R322  0R  [CR1005-0402]
R323  0R  [CR1005-0402]
R324  0R  [CR1005-0402]
R325  0R  [CR1005-0402]
R326  22R  [CR1005-0402]
R327  0R  [CR1005-0402]
R328  0R  [CR1005-0402]
R329  0R  [CR1005-0402]
R330  0R  [CR1005-0402]
R331  0R  [CR1005-0402]
R332  0R  [CR1005-0402]
R333  0R  [CR1005-0402]
S300  8 Ohms/1W  (mechanical)
S301  32 Ohms/26mW  (mechanical)
U300  FSA2259  [QFN-10FSA]  (parts A,B of 2)
U301  WM8940  [QFN24]
U302  74LVC1G384  [SOT753]

### Ports
JACK_EN (out), MCLK (in), SCL (in), SDA (bidir), SPK/~{HP} (in), SPORT_CLK (in), SPORT_FS (in), SPORT_RX (out), SPORT_TX (in)

### Nets
AGND: C300.1 C301.1 C302.1 C303.2 C304.1 C307.1 C309.1 C310.2 C311.2 C312.2 C313.2 C314.1 C315.1 J301.2 J302.10 R303.2 R314.2 R316.1 R318.2 U300.6(GND) U301.3(AGND) U301.6(DGND) U301.18(SPKGND) U302.3(GND)  [also labelled GND]
AVCC3V3: C301.2 C302.2 C310.1 C311.1 L300.2 U301.2(AVDD) U301.20(SPKVDD)
VBAT: R315.1
VCC1V8: C313.1 J302.2 U301.4(DCVDD)
VCC3V3: C300.2 C303.1 C312.1 C314.2 C315.2 J302.1 L300.1 R306.2 R310.2 U300.1(VCC) U301.5(DBVDD) U302.5(VCC)
HP_GND: CON301.1(GND) U300.7(2B0)
HP_OUT: CON301.3(TIP) R314.1 U300.5(1B0)
JACK_EN: CON301.5(TIPR) R310.1 R317.2 U301.12(CSB/GPIO) ; port JACK_EN
MCLK: R326.2 ; port MCLK
MCLK_CON: R325.1 R326.1 R333.2
MONOOUT: U300.9(2A) U301.16(MONOOUT) U302.1(Y)
SCL: R319.1 R327.2 ; port SCL
SCLK_CON: R312.1 R324.1 R332.2
SDA: R320.1 R328.2 ; port SDA
SFS_CON: R311.1 R323.1 R331.2
SPK/~{HP}: R306.1 U300.4(S1) U300.8(S2) ; port SPK/~{HP}
SPK_OUT: J300.1 U300.2(1B1)
SPKOUTL: CON301.2(RING) J300.2 U301.19(SPKOUTN)
SPKOUTP: U300.3(1A) U301.17(SPKOUTP)
SPORT_CLK: R312.2 ; port SPORT_CLK
SPORT_FS: R311.2 ; port SPORT_FS
SPORT_RX: R308.2 ; port SPORT_RX
SPORT_TX: R309.2 ; port SPORT_TX
SRX_CON: R308.1 R321.1 R329.2
STX_CON: R309.1 R322.1 R330.2
NetC304_2: C304.2 R304.1
NetC305_1: C305.1 U301.24(MICP)
NetC305_2: C305.2 CON300.3(TIP)
NetC306_1: C306.1 U301.23(MICIN)
NetC306_2: C306.2 CON300.1(GND) CON300.2(RING) CON300.4(RINGR) M300.2(GND)
NetC307_2: C307.2 U301.22(VMID)
NetC308_1: C308.1 U302.2(Z)
NetC308_2: C308.2 C309.2 J301.1 R318.1
NetCON300_5: CON300.5(TIPR) M300.1(OUT)
NetJ302_3: J302.3 R327.1
NetJ302_4: J302.4 R328.1
NetJ302_5: J302.5 R329.1
NetJ302_6: J302.6 R330.1
NetJ302_7: J302.7 R331.1
NetJ302_8: J302.8 R332.1
NetJ302_9: J302.9 R333.1
NetR303_1: R303.1 U301.15(MOD)
NetR304_2: R304.2 U301.1(MICBIAS)
NetR313_1: R313.1 U301.21(AUX)
NetR313_2: R313.2 R315.2 R316.2
NetR317_1: R317.1 U302.4(~{OE})
NetR319_2: R319.2 U301.13(SCLK)
NetR320_2: R320.2 U301.14(SDIN)
NetR321_2: R321.2 U301.7(ADCDAT)
NetR322_2: R322.2 U301.8(DACDAT)
NetR323_2: R323.2 U301.9(FRAME)
NetR324_2: R324.2 U301.10(BCLK)
NetR325_2: R325.2 U301.11(MCLK)

Not connected (* = marked no-connect by the designer): CON301 4(RINGR)*; S300 1(CKT1)* 2(CKT2)*; S301 1(CKT1)* 2(CKT2)*; U300 10(2B1)*

### Notes on the sheet
- Título:
- Universidade Federal do Ceará
- Padrão:
- Projeto:
- A3
- Blackfin IP Phone
- Data:
- Versão:
- Folha:
- V1
- de
- Centro de Tecnologia
- Dep. de Eng. de Teleinformática
- Fortaleza - Ceará - Brasil
- Arquivo:

### Library data of the parts
C300 = Capacitor: MLCC - SMD/SMT 100nF 16V 10% 0402; eVendorPart#: 810-C1005X7R1C104K; Manufacturer: TDK; Part#: C1005X7R1C104KT; eVendor: Mouser; eVendorPrice: 0,03; MSRP: 0,005; MOQ: 1000
C301 = Capacitor: MLCC - SMD/SMT 47nF 16V 10% 0402; eVendorPart#: 311-1334-1-ND; Manufacturer: Yageo; Part#: CC0402KRX7R6BB473; eVendor: Digikey; eVendorPrice: 0,02; MSRP: 0,00429; MOQ: 1000
C302 = Capacitor: MLCC - SMD/SMT 1nF 16V 10% 0402; eVendorPart#: 311-1352-1-ND; Manufacturer: Yageo; Part#: CC0402KRX7R7BB102; eVendor: Digikey; eVendorPrice: 0,015; MSRP: 0,00335; MOQ: 1000
C303 = Capacitor_Electrolytic: Aluminum Electrolytic Capacitors - SMD 6.3 Volts 10uF 20%; eVendorPart#: 140-VE100M0JTR0305; Manufacturer: Lelon; eVendor: Mouser; MSRP: 0,099; eVendorPrice: 0,18; Part#: VE-100M0JTR-0305; MOQ: 1000
C304 C307 C310-C313 = Capacitor: MLCC - SMD/SMT 4.7uF 20% 6.3Volts 0402; eVendorPart#: 810-C1005X5R0J475M; Manufacturer: TDK; Part#: C1005X5R0J475MT; eVendor: Mouser; eVendorPrice: 0,22; MSRP: 0,108; MOQ: 1000
C305 C306 = Capacitor: CAP CER 1.0UF 6.3V 20% X5R 0402; eVendorPart#: 490-1319-1-ND; Manufacturer: Murata Electronics North America; Part#: GRM155R60J105ME19D; eVendor: Digikey; eVendorPrice: 0,055; MSRP: 0,01193; MOQ: 1000
C308 = Capacitor_Electrolytic: Aluminum Electrolytic Capacitors - SMD 6.3 Volts 220uF 20%; eVendorPart#: 140-VE221M0JTR0605; Part#: VE-221M0JTR-0605; Manufacturer: Lelon; eVendor: Mouser; MSRP: 0,07; eVendorPrice: 0,16; MOQ: 1000
C309 = Capacitor: Capacitor 220pF 0402; eVendorPart#: 311-1035-1-ND; Manufacturer: Yageo; Part#: CC0402KRX7R9BB221; eVendor: Digikey; eVendorPrice: 0,015; MSRP: 0,00335; MOQ: 1000
C314 C315 = Capacitor: as C200 on sheet ip_phone_b_miscellaneous; MOQ: 1000
CON300 CON301 = Phone_Jack_1: eVendorPart#: CP1-2535SJCT-ND; Manufacturer: CUI Inc; Part#: SJ1-2535-SMT; eVendorPrice: 0,75; eVendor: Digikey; MSRP: 0,415; MOQ: 1000
CR300-CR305 = Crimp: Socket Crimp; eVendorPart#: 656-ILZC3A115000; Part#: IL-Z-C3-A-1-15000; Manufacturer: JAE Electronics; eVendor: Mouser; eVendorPrice: 0,05; MSRP: 0,049; MOQ: 1000
J300 J301 = Speaker_con: Connector 2 Pin 1.25mm Male; eVendorPart#: 656-IL-Z-2PL-SMTYE; Manufacturer: JAE Electronics; Part#: IL-Z-2PL-SMTYE; eVendor: Mouser; eVendorPrice: 0,33; MSRP: 0,22; MOQ: 1000
J302 = Conector 10pin: as J201 on sheet ip_phone_b_miscellaneous; MOQ: 1000; NP: NP
L300 = Inductor: Ferrite Bead 60 Ohm @100MHz; eVendorPart#: 667-EXC-3BP600H; Manufacturer: Panasonic Electronic Components; Part#: EXC-3BP600H; eVendor: Mouser; eVendorPrice: 0,11; MSRP: 0,066; MOQ: 1000
M300 = MIC: Microphones -38DB 2VDC .5MA 2.2KOHM; Part#: POM-2738P-C33-R; Manufacturer: PUI Audio; eVendorPart#: 665-POM2738PC33R; eVendor: Mouser; eVendorPrice: 1,98; MSRP: 1,13; MOQ: 500
P300-P302 = Socket Housing: Socket Housing 1.25mm 2 Pins; eVendorPart#: 656-IL-Z-2S-S125C3; Part#: IL-Z-2S-S125C3; Manufacturer: JAE Electronics; eVendor: Mouser; eVendorPrice: 0,11; MSRP: 0,042; MOQ: 1000
R303 R306 = Resistor: as R144 on sheet ip_phone_a_sdram; MOQ: 1000
R304 = Resistor: Thick Film Resistors SMD 0402 2K2 5%  1/16 W; eVendorPart#: 311-2.2KJRCT-ND; Manufacturer: Yageo; Part#: RC0402JR-072K2L; eVendor: Digikey; eVendorPrice: 0,012; MSRP: 0,00253; MOQ: 1000
R308 R309 R311 R312 R326 = Resistor: as R100 on sheet ip_phone_a_sdram; MOQ: 1000
R310 R316 = Resistor: as R137 on sheet ip_phone_a_sdram; MOQ: 1000
R313 R317 R319-R325 R327-R333 = Resistor: as R202 on sheet ip_phone_b_miscellaneous; MOQ: 1000
  R327-R333: NP: NP
R314 = Resistor: as R206 on sheet ip_phone_b_miscellaneous; MOQ: 1000
R315 = Resistor: Thick Film Resistor 330K 1% 1/16W; eVendorPart#: RMCF0402FT330KCT-ND; Manufacturer: Stackpole Electronics Inc; Part#: RMCF0402FT330K; eVendor: Digikey; eVendorPrice: 0,04; MSRP: 0,00384; MOQ: 1000
R318 = Resistor: Thick Film Resistors SMD 0402 47K 5%  1/16 W; eVendorPart#: 311-47KJRCT-ND; Manufacturer: Yageo; Part#: RC0402JR-0747KL; eVendor: Digikey; eVendorPrice: 0,012; MSRP: 0,00253; MOQ: 1000
S300 = Speaker: Speaker 8 Ohms 1W; eVendorPart#: 254-DS238-RO; Manufacturer: Kobitone; eVendor: Mouser; eVendorPrice: 2,25; MSRP: 1,32; Part#: 254-DS238-RO; MOQ: 1000
S301 = Receiver: Dynamic Receiver 32Ohms 26mW 115dB 13mm D; eVendorPart#: 254-DR132-RO; manufacturer: Kobitone; eVendor: Mouser; eVendorPrice: 1,98; MSRP: 1,52; MOQ: 1000; Part#: 254-DR132-RO
U300 = FSA2259: Analog Switch, Dual SPDT; eVendorPart#: 512-FSA2259UMX; Manufacturer: Fairchild Semiconductor; Part#: FSA2259UMX; eVendor: Mouser; eVendorPrice: 0,68; MSRP: 0,22; MOQ: 1000
U301 = WM8940: Mono Audio CODEC; eVendorPart#: 238-WM8940GEFL/V; Part#: WM8940GEFL/V; Manufacturer: Wolfson Microelectronics; eVendor: Mouser; eVendorPrice: 2,82; MSRP: 1,70; MOQ: 1000
U302 = 74LVC1G384: Low Voltage SPST Analog Switch; eVendorPart#: 771-LVC1G384GV125; Part#: 74LVC1G384GV,125; Manufacturer: NXP Semiconductors; eVendor: Mouser; eVendorPrice: 0,07; MSRP: 0,046; MOQ: 1000

## Sheet ip_phone_d_lcd_keyboard.SchDoc: LCD e Display
size A3; SheetNumber: 4; SheetTotal: 6
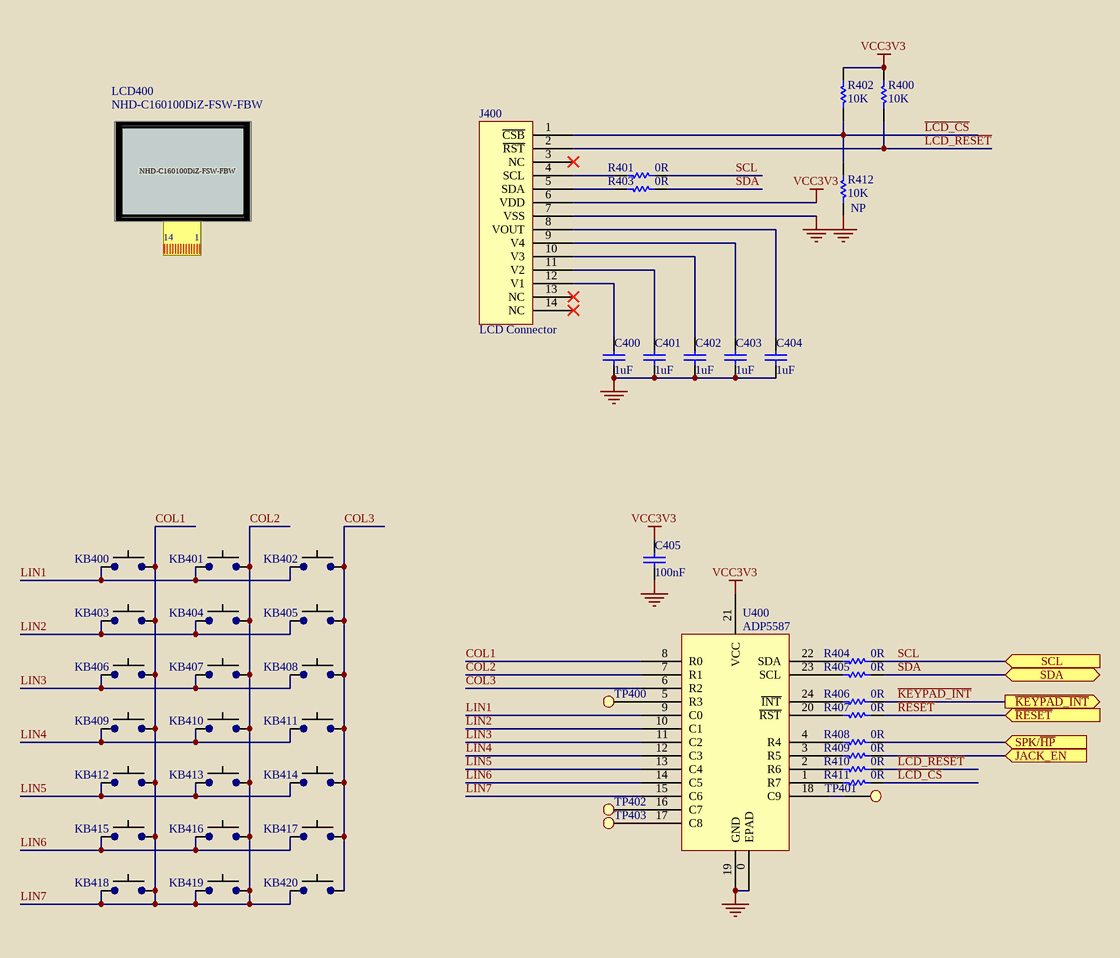
[diagram p3: ip_phone_d_lcd_keyboard.SchDoc]

### Parts
C400  1uF  [CC1005-0402]
C401  1uF  [CC1005-0402]
C402  1uF  [CC1005-0402]
C403  1uF  [CC1005-0402]
C404  1uF  [CC1005-0402]
C405  100nF  [CC1005-0402]
J400  LCD Connector  [LCD_Connector]
KB400  Keypad_Button  [Keypad_Button]  (value not drawn)  (no BOM)
KB401  Keypad_Button  [Keypad_Button]  (value not drawn)  (no BOM)
KB402  Keypad_Button  [Keypad_Button]  (value not drawn)  (no BOM)
KB403  Keypad_Button  [Keypad_Button]  (value not drawn)  (no BOM)
KB404  Keypad_Button  [Keypad_Button]  (value not drawn)  (no BOM)
KB405  Keypad_Button  [Keypad_Button]  (value not drawn)  (no BOM)
KB406  Keypad_Button  [Keypad_Button]  (value not drawn)  (no BOM)
KB407  Keypad_Button  [Keypad_Button]  (value not drawn)  (no BOM)
KB408  Keypad_Button  [Keypad_Button]  (value not drawn)  (no BOM)
KB409  Keypad_Button  [Keypad_Button]  (value not drawn)  (no BOM)
KB410  Keypad_Button  [Keypad_Button]  (value not drawn)  (no BOM)
KB411  Keypad_Button  [Keypad_Button]  (value not drawn)  (no BOM)
KB412  Keypad_Button  [Keypad_Button]  (value not drawn)  (no BOM)
KB413  Keypad_Button  [Keypad_Button]  (value not drawn)  (no BOM)
KB414  Keypad_Button  [Keypad_Button]  (value not drawn)  (no BOM)
KB415  Keypad_Button  [Keypad_Button]  (value not drawn)  (no BOM)
KB416  Keypad_Button  [Keypad_Button]  (value not drawn)  (no BOM)
KB417  Keypad_Button  [Keypad_Button]  (value not drawn)  (no BOM)
KB418  Keypad_Button  [Keypad_Button]  (value not drawn)  (no BOM)
KB419  Keypad_Button  [Keypad_Button]  (value not drawn)  (no BOM)
KB420  Keypad_Button  [Keypad_Button]  (value not drawn)  (no BOM)
LCD400  NHD-C160100DiZ-FSW-FBW  (mechanical)
R400  10K  [CR1005-0402]
R401  0R  [CR1005-0402]
R402  10K  [CR1005-0402]
R403  0R  [CR1005-0402]
R404  0R  [CR1005-0402]
R405  0R  [CR1005-0402]
R406  0R  [CR1005-0402]
R407  0R  [CR1005-0402]
R408  0R  [CR1005-0402]
R409  0R  [CR1005-0402]
R410  0R  [CR1005-0402]
R411  0R  [CR1005-0402]
R412  10K  [CR1005-0402]
TP400  Test Point  [Test Point]  (value not drawn)  (no BOM)
TP401  Test Point  [Test Point]  (value not drawn)  (no BOM)
TP402  Test Point  [Test Point]  (value not drawn)  (no BOM)
TP403  Test Point  [Test Point]  (value not drawn)  (no BOM)
U400  ADP5587  [QFN-24]

### Ports
JACK_EN (in), SCL (in), SDA (bidir), SPK/~{HP} (in), ~{KEYPAD_INT} (out), ~{RESET} (in)

### Nets
GND: C400.2 C401.2 C402.2 C403.2 C404.2 C405.1 J400.7(VSS) R412.1 U400.0(EPAD) U400.19(GND)  [project net AGND]
VCC3V3: C405.2 J400.6(VDD) R400.2 R402.2 U400.21(VCC)
~{KEYPAD_INT}: R406.1 ; port ~{KEYPAD_INT}
~{RESET}: R407.1 ; port ~{RESET}
COL1: KB400.2 KB401.2 KB403.2 KB404.2 KB406.2 KB407.2 KB409.2 KB410.2 KB412.2 KB413.2 KB415.2 KB416.2 KB418.1 KB418.2 KB419.1 KB419.2 KB420.1 U400.7(R1) U400.8(R0) U400.15(C6)  [also labelled COL2, LIN7]
COL3: KB402.2 KB405.2 KB408.2 KB411.2 KB414.2 KB417.2 KB420.2 U400.6(R2)
JACK_EN: R409.1 ; port JACK_EN
~{LCD_CS}: J400.1(~{CSB}) R402.1 R411.1 R412.2
~{LCD_RESET}: J400.2(~{RST}) R400.1 R410.1
LIN1: KB400.1 KB401.1 KB402.1 U400.9(C0)
LIN2: KB403.1 KB404.1 KB405.1 U400.10(C1)
LIN3: KB406.1 KB407.1 KB408.1 U400.11(C2)
LIN4: KB409.1 KB410.1 KB411.1 U400.12(C3)
LIN5: KB412.1 KB413.1 KB414.1 U400.13(C4)
LIN6: KB415.1 KB416.1 KB417.1 U400.14(C5)
SCL: R401.1 R404.1 ; port SCL
SDA: R403.1 R405.1 ; port SDA
SPK/~{HP}: R408.1 ; port SPK/~{HP}
NetC400_1: C400.1 J400.12(V1)
NetC401_1: C401.1 J400.11(V2)
NetC402_1: C402.1 J400.10(V3)
NetC403_1: C403.1 J400.9(V4)
NetC404_1: C404.1 J400.8(VOUT)
NetJ400_4: J400.4(SCL) R401.2
NetJ400_5: J400.5(SDA) R403.2
NetR404_2: R404.2 U400.22(SDA)
NetR405_2: R405.2 U400.23(SCL)
NetR406_2: R406.2 U400.24(~{INT})
NetR407_2: R407.2 U400.20(~{RST})
NetR408_2: R408.2 U400.4(R4)
NetR409_2: R409.2 U400.3(R5)
NetR410_2: R410.2 U400.2(R6)
NetR411_2: R411.2 U400.1(R7)
NetTP400_1: TP400.1 U400.5(R3)
NetTP401_1: TP401.1 U400.18(C9)
NetTP402_1: TP402.1 U400.16(C7)
NetTP403_1: TP403.1 U400.17(C8)

Not connected (* = marked no-connect by the designer): J400 3(NC)* 13(NC)* 14(NC)*

### Notes on the sheet
- Título:
- Universidade Federal do Ceará
- Padrão:
- Projeto:
- A3
- Blackfin IP Phone
- Data:
- Versão:
- Folha:
- V1
- de
- Centro de Tecnologia
- Dep. de Eng. de Teleinformática
- Fortaleza - Ceará - Brasil
- Arquivo:
- (in symbol LCD) 14; 1

### Library data of the parts
C400-C404 = Capacitor: as C305 on sheet ip_phone_c_codec; MOQ: 1000
C405 = Capacitor: as C200 on sheet ip_phone_b_miscellaneous; MOQ: 1000
J400 = LCD Connector: eVendorPart#: 538-52892-1495; Manufacturer: Molex; Part#: 52892-1495; eVendor: Mouser; eVendorPrice: 1,27; MSRP: 0,45; MOQ: 1000
LCD400 = LCD: eVendorPart#: 763-C160100DIZFSWFBW; Manufacturer: Newhaven Display; eVendor: Mouser; eVendorPrice: 18,55; MSRP: 15,39; Part#: NHD-C160100DiZ-FSW-FBW; MOQ: 50
R400 R402 R412 = Resistor: as R144 on sheet ip_phone_a_sdram; MOQ: 1000
  R402 R412: NP: NP
R401 R403-R411 = Resistor: as R202 on sheet ip_phone_b_miscellaneous; MOQ: 1000
TP400-TP403 = Test Point: as TP100 on sheet ip_phone_a_sdram; eVendorPart#: NÃO SE APLICA; Part#: NÃO SE APLICA; Manufacturer: NÃO SE APLICA; MOQ: 1000; MSRP: 0,00
U400 = ADP5587: IC Expander/Keyboard Controller; eVendorPart#: ADP5587ACPZ-R7CT-ND; Part#: ADP5587ACPZ-R7; Manufacturer: Analog Devices; eVendor: Digikey; MSRP: 1,725; eVendorPrice: 3,45; MOQ: 1000
KB400-KB420 = Keypad_Button: eVendor: *; eVendorPart#: *; Part#: *; eVendorPrice: *; MOQ: *; MSRP: *; Manufacturer: *

## Sheet ip_phone_e_wifi.SchDoc: WIFI
size A3; SheetNumber: 5; SheetTotal: 6
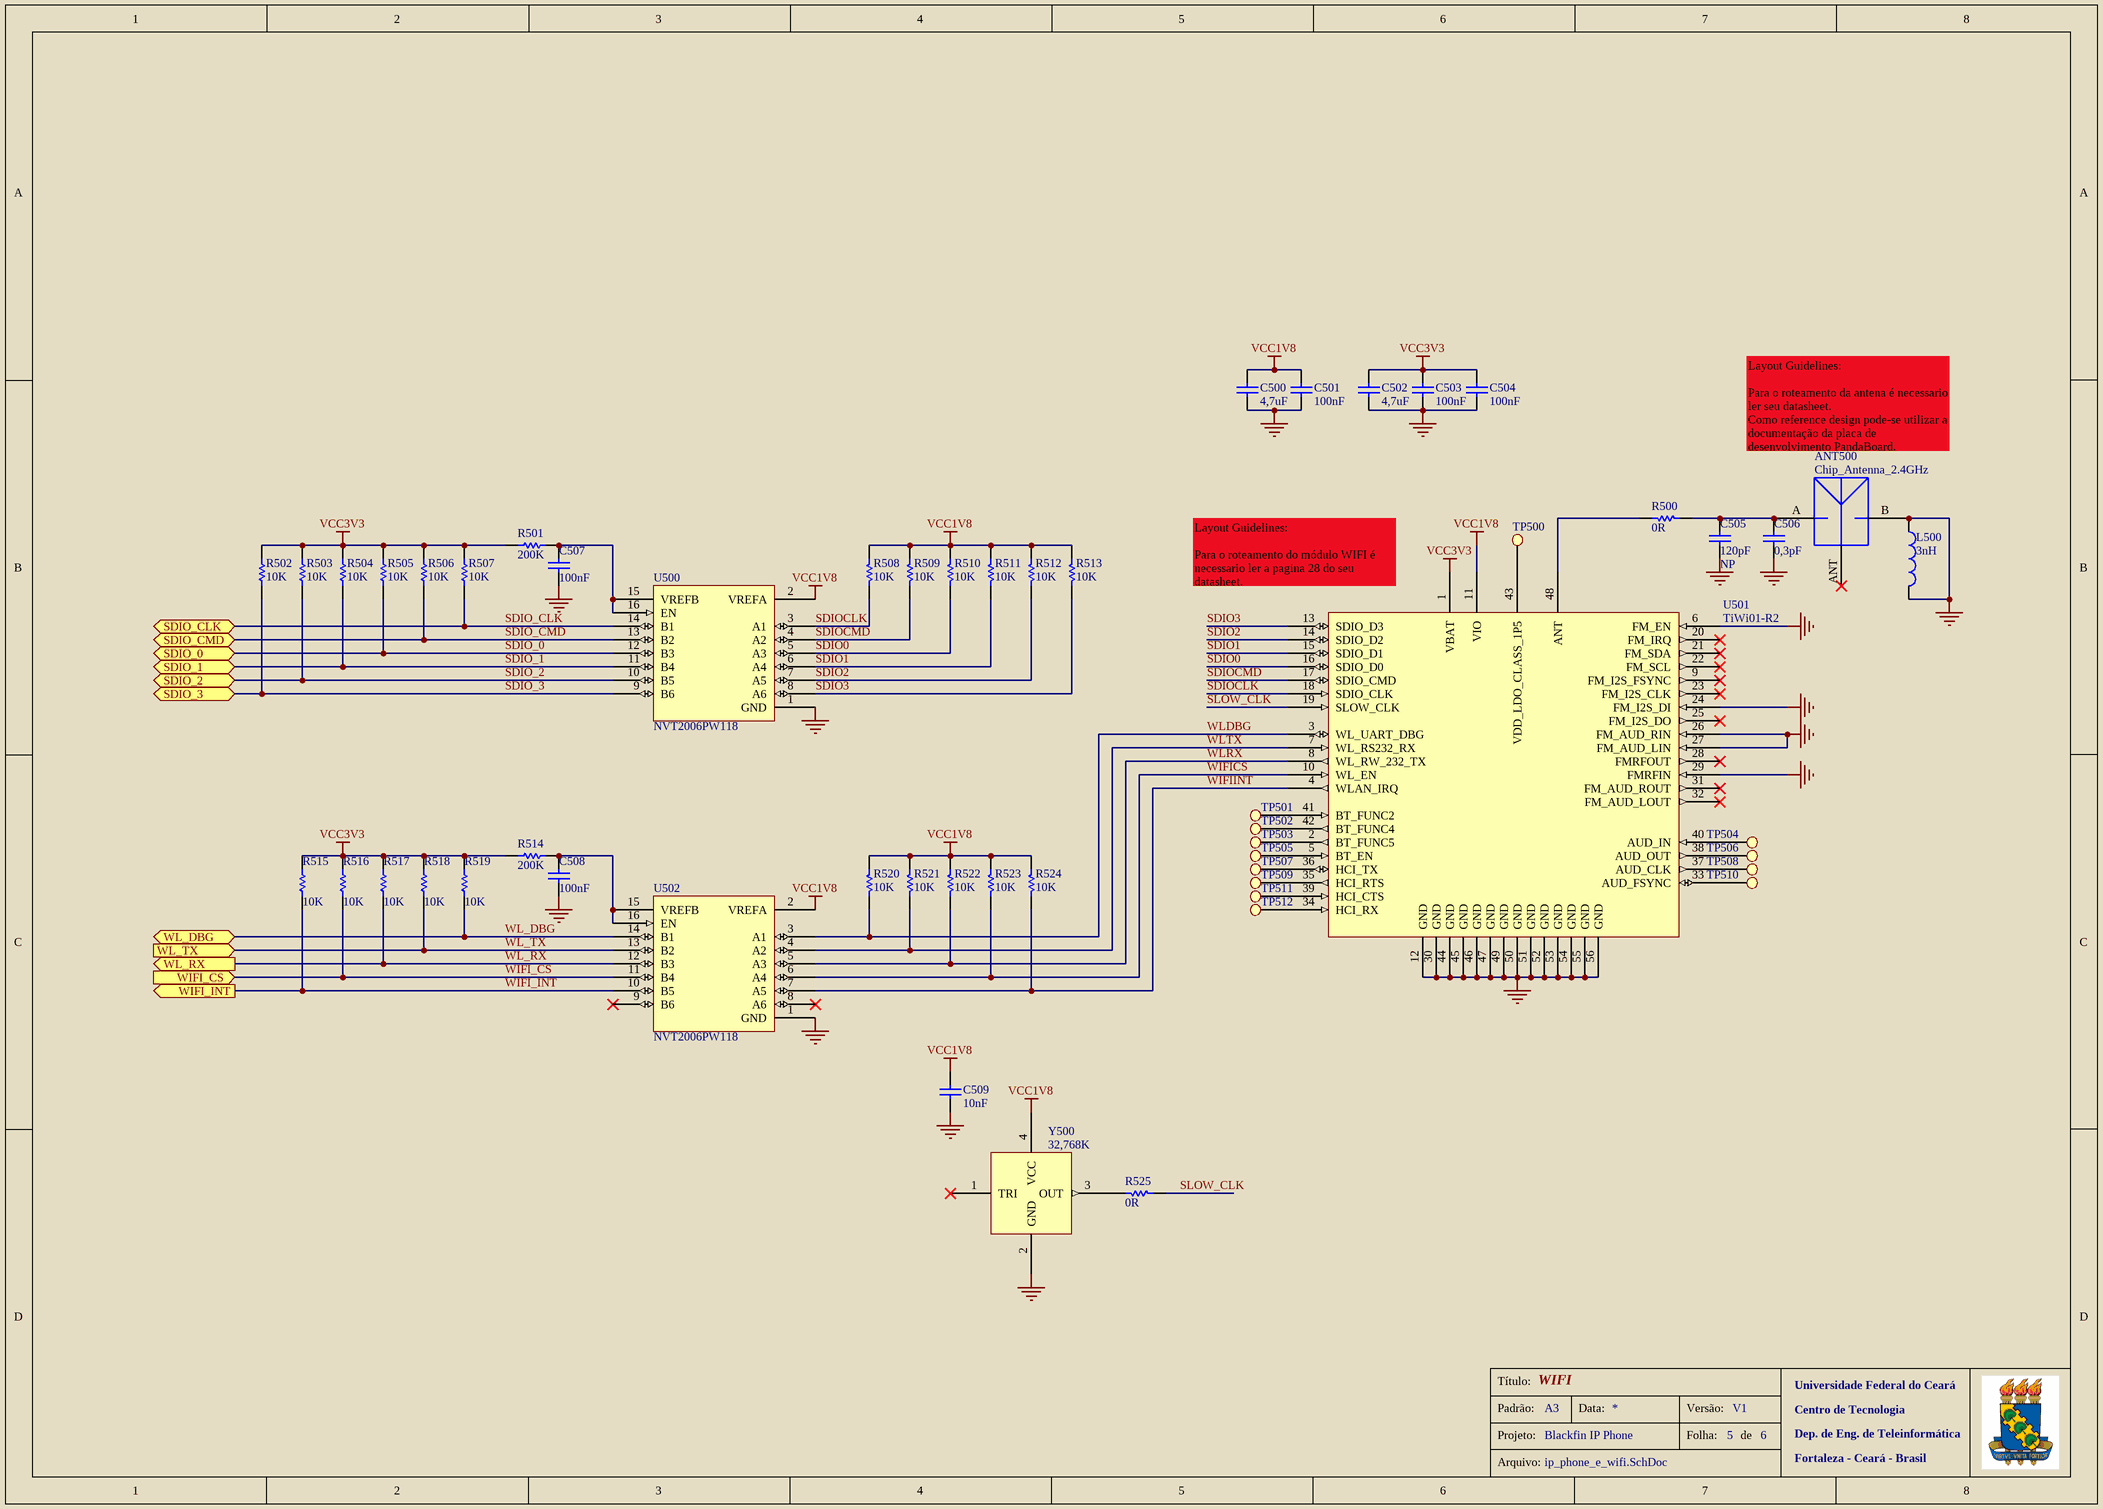
[diagram p4: ip_phone_e_wifi.SchDoc]

### Parts
ANT500  Chip_Antenna_2.4GHz  [ANTENNA]
C500  4,7uF  [CC1005-0402]
C501  100nF  [CC1005-0402]
C502  4,7uF  [CC1005-0402]
C503  100nF  [CC1005-0402]
C504  100nF  [CC1005-0402]
C505  120pF  [CC1005-0402_NP]
C506  0,3pF  [CC1005-0402]
C507  100nF  [CC1005-0402]
C508  100nF  [CC1005-0402]
C509  10nF  [CC1005-0402]
L500  3nH  [INDUTOR_0402]
R500  0R  [CR1005-0402]
R501  200K  [CR1005-0402]
R502  10K  [CR1005-0402]
R503  10K  [CR1005-0402]
R504  10K  [CR1005-0402]
R505  10K  [CR1005-0402]
R506  10K  [CR1005-0402]
R507  10K  [CR1005-0402]
R508  10K  [CR1005-0402]
R509  10K  [CR1005-0402]
R510  10K  [CR1005-0402]
R511  10K  [CR1005-0402]
R512  10K  [CR1005-0402]
R513  10K  [CR1005-0402]
R514  200K  [CR1005-0402]
R515  10K  [CR1005-0402]
R516  10K  [CR1005-0402]
R517  10K  [CR1005-0402]
R518  10K  [CR1005-0402]
R519  10K  [CR1005-0402]
R520  10K  [CR1005-0402]
R521  10K  [CR1005-0402]
R522  10K  [CR1005-0402]
R523  10K  [CR1005-0402]
R524  10K  [CR1005-0402]
R525  0R  [CR1005-0402]
TP500  Test Point  [Test Point]  (value not drawn)  (no BOM)
TP501  Test Point  [Test Point]  (value not drawn)  (no BOM)
TP502  Test Point  [Test Point]  (value not drawn)  (no BOM)
TP503  Test Point  [Test Point]  (value not drawn)  (no BOM)
TP504  Test Point  [Test Point]  (value not drawn)  (no BOM)
TP505  Test Point  [Test Point]  (value not drawn)  (no BOM)
TP506  Test Point  [Test Point]  (value not drawn)  (no BOM)
TP507  Test Point  [Test Point]  (value not drawn)  (no BOM)
TP508  Test Point  [Test Point]  (value not drawn)  (no BOM)
TP509  Test Point  [Test Point]  (value not drawn)  (no BOM)
TP510  Test Point  [Test Point]  (value not drawn)  (no BOM)
TP511  Test Point  [Test Point]  (value not drawn)  (no BOM)
TP512  Test Point  [Test Point]  (value not drawn)  (no BOM)
U500  NVT2006PW118  [TSSOP16]
U501  TiWi01-R2  [WIFI_MODULE]
U502  NVT2006PW118  [TSSOP16]
Y500  32,768K  [OSCILLATOR_32K]

### Ports
SDIO_0 (bidir), SDIO_1 (bidir), SDIO_2 (bidir), SDIO_3 (bidir), SDIO_CLK (bidir), SDIO_CMD (bidir), WIFI_CS (in), WIFI_INT (out), WL_DBG (bidir), WL_RX (out), WL_TX (in)

### Nets
GND: ANT500.B(FIXINGELEC) C500.2 C501.2 C502.2 C503.2 C504.2 C505.1 C506.1 C507.1 C508.1 C509.1 L500.1 L500.2 U500.1(GND) U501.6(FM_EN) U501.12(GND) U501.24(FM_I2S_DI) U501.26(FM_AUD_RIN) U501.27(FM_AUD_LIN) U501.29(FMRFIN) U501.30(GND) U501.44(GND) U501.45(GND) U501.46(GND) U501.47(GND) U501.49(GND) U501.50(GND) U501.51(GND) U501.52(GND) U501.53(GND) U501.54(GND) U501.55(GND) U501.56(GND) U502.1(GND) Y500.2(GND)  [project net AGND]
VCC1V8: C500.1 C501.1 C509.2 R508.2 R509.2 R510.2 R511.2 R512.2 R513.2 R520.2 R521.2 R522.2 R523.2 R524.2 U500.2(VREFA) U501.11(VIO) U502.2(VREFA) Y500.4(VCC)
VCC3V3: C502.1 C503.1 C504.1 R501.2 R502.1 R503.1 R504.1 R505.1 R506.1 R507.1 R514.2 R515.2 R516.2 R517.2 R518.2 R519.2 U501.1(VBAT)
SDIO0: R510.1 U500.5(A3) U501.16(SDIO_D0)
SDIO1: R511.1 U500.6(A4) U501.15(SDIO_D1)
SDIO2: R512.1 U500.7(A5) U501.14(SDIO_D2)
SDIO3: R513.1 U500.8(A6) U501.13(SDIO_D3)
SDIO_0: R505.2 U500.12(B3) ; port SDIO_0
SDIO_1: R504.2 U500.11(B4) ; port SDIO_1
SDIO_2: R503.2 U500.10(B5) ; port SDIO_2
SDIO_3: R502.2 U500.9(B6) ; port SDIO_3
SDIO_CLK: R507.2 U500.14(B1) ; port SDIO_CLK
SDIO_CMD: R506.2 U500.13(B2) ; port SDIO_CMD
SDIOCLK: R508.1 U500.3(A1) U501.18(SDIO_CLK)
SDIOCMD: R509.1 U500.4(A2) U501.17(SDIO_CMD)
SLOW_CLK: R525.1 U501.19(SLOW_CLK)
WIFI_CS: R516.1 U502.11(B4) ; port WIFI_CS
WIFI_INT: R515.1 U502.10(B5) ; port WIFI_INT
WIFICS: R523.1 U501.10(WL_EN) U502.6(A4)
WIFIINT: R524.1 U501.4(WLAN_IRQ) U502.7(A5)
WL_DBG: R519.1 U502.14(B1) ; port WL_DBG
WL_RX: R517.1 U502.12(B3) ; port WL_RX
WL_TX: R518.1 U502.13(B2) ; port WL_TX
WLDBG: R520.1 U501.3(WL_UART_DBG) U502.3(A1)
WLRX: R522.1 U501.8(WL_RW_232_TX) U502.5(A3)
WLTX: R521.1 U501.7(WL_RS232_RX) U502.4(A2)
NetANT500_A: ANT500.A(FEEDPOINT) C505.2 C506.2 R500.1
NetC507_2: C507.2 R501.1 U500.15(VREFB) U500.16(EN)
NetC508_2: C508.2 R514.1 U502.15(VREFB) U502.16(EN)
NetR500_2: R500.2 U501.48(ANT)
NetR525_2: R525.2 Y500.3(OUT)
NetTP500_1: TP500.1 U501.43(VDD_LDO_CLASS_1P5)
NetTP501_1: TP501.1 U501.41(BT_FUNC2)
NetTP502_1: TP502.1 U501.42(BT_FUNC4)
NetTP503_1: TP503.1 U501.2(BT_FUNC5)
NetTP504_1: TP504.1 U501.40(AUD_IN)
NetTP505_1: TP505.1 U501.5(BT_EN)
NetTP506_1: TP506.1 U501.38(AUD_OUT)
NetTP507_1: TP507.1 U501.36(HCI_TX)
NetTP508_1: TP508.1 U501.37(AUD_CLK)
NetTP509_1: TP509.1 U501.35(HCI_RTS)
NetTP510_1: TP510.1 U501.33(AUD_FSYNC)
NetTP511_1: TP511.1 U501.39(HCI_CTS)
NetTP512_1: TP512.1 U501.34(HCI_RX)

Not connected (* = marked no-connect by the designer): ANT500 ANT(ANTENNA)*; U501 9(FM_I2S_FSYNC)* 20(FM_IRQ)* 21(FM_SDA)* 22(FM_SCL)* 23(FM_I2S_CLK)* 25(FM_I2S_DO)* 28(FMRFOUT)* 31(FM_AUD_ROUT)* 32(FM_AUD_LOUT)*; U502 8(A6)* 9(B6)*; Y500 1(TRI)*

### Notes on the sheet
- Layout Guidelines:
  Para o roteamento da antena é necessario ler seu datasheet.
  Como reference design pode-se utilizar a documentação da placa de desenvolvimento PandaBoard.
- (near U501) Layout Guidelines:
  Para o roteamento do módulo WIFI é necessario ler a pagina 28 do seu datasheet.
- Título:
- Universidade Federal do Ceará
- Padrão:
- Projeto:
- A3
- Blackfin IP Phone
- Data:
- Versão:
- Folha:
- V1
- de
- Centro de Tecnologia
- Dep. de Eng. de Teleinformática
- Fortaleza - Ceará - Brasil
- Arquivo:

### Library data of the parts
ANT500 = Antenna2_4GHzChip: Antenna 2.4GHz Ceramic Chip SMD; Manufacturer: TDK; eVendorPart#: 445-6134-1-ND; Part#: ANT040015CCS2442MA1; eVendorPrice: 5,94; eVendor: Digikey; MSRP: 3,15; MOQ: 1000
C500 C502 = Capacitor: as C304 on sheet ip_phone_c_codec; MOQ: 1000
C501 C503 C504 C507 C508 = Capacitor: as C200 on sheet ip_phone_b_miscellaneous; MOQ: 1000
C505 = Capacitor: MLCC - SMD/SMT 0402 120pF 50volts C0G 5%; eVendorPart#: 810-C1005C0G1H121J; Manufacturer: TDK; Part#: C1005C0G1H121JT; eVendor: Mouser; eVendorPrice: 0,03; MSRP: 0,007; MOQ: 1000; NP: NP
C506 = Capacitor: MLCC - SMD/SMT 0.3pF 50Volts C0G 0.1pF; eVendorPart#: 81-GRM1535C1HR30BD5D; Manufacturer: Murata; Part#: GRM1535C1HR30BDD5D; eVendor: Mouser; eVendorPrice: 0,15; MSRP: 0,012; MOQ: 1000
C509 = Capacitor: Ceramic Capacitor 10nF 50V X7R 0402; eVendorPart#: 810-C1005X7R1C103K; Manufacturer: TDK; Part#: C1005X7R1C103KT; eVendor: Mouser; eVendorPrice: 0,03; MSRP: 0,004; MOQ: 1000
L500 = Inductor: eVendorPart#: 712-1457-1-ND; Manufacturer: Johanson Technology Inc; Part#: L-07C3N0SV6T; eVendor: Digikey; eVendorPrice: 0,04; MSRP: 0,225; MOQ: 1000
R500 R525 = Resistor: as R202 on sheet ip_phone_b_miscellaneous; MOQ: 1000
R501 R514 = Resistor: Thick Film Resistors 1/16WATT 200K 0402; eVendorPart#: 304-200K-RC; Manufacturer: Xicon; eVendor: Mouser; eVendorPrice: 0,04; MSRP: 0,016; MOQ: 1000; Part#: 304-200K-RC
R502-R513 R515-R524 = Resistor: as R144 on sheet ip_phone_a_sdram; MOQ: 1000
TP500-TP512 = Test Point: as TP100 on sheet ip_phone_a_sdram; eVendorPart#: NÃO SE APLICA; Part#: NÃO SE APLICA; Manufacturer: NÃO SE APLICA; MOQ: 1000; MSRP: 0,00
U500 U502 = NVT2006PW118: Translation - Voltage Levels +/-50mA 1.5ns 2.1-5V; eVendorPart#: 771-NVT2006PW118; Manufacturer: NXP Semiconductors; Part#: NVT2006PW,118; eVendor: Mouser; eVendorPrice: 0,76; MSRP: 0,375; MOQ: 1000
U501 = TiWi01-R2: WiFi / 802.11 TiWi01-R2 Module with U.FL Connector; eVendorPart#: 741-450-0037; Manufacturer: LS Research; Part#: 450-0037; eVendor: Mouser; eVendorPrice: 32,55; MSRP: 30,80; MOQ: 100
Y500 = Oscillator_32K: Standard Clock Oscillators 32.768KHz 1.8V -40C +85C 25ppm; eVendorPart#: 815-ASEK2-32.7K-LRT; Manufacturer: Abracon; Part#: ASEK2-32.768KHz-LRT; eVendor: Mouser; eVendorPrice: 3,66; MSRP: 2,44; MOQ: 500